# EasyEDA Pro project CustomDevKit.epro, board SimWheelKit_unified_REV2
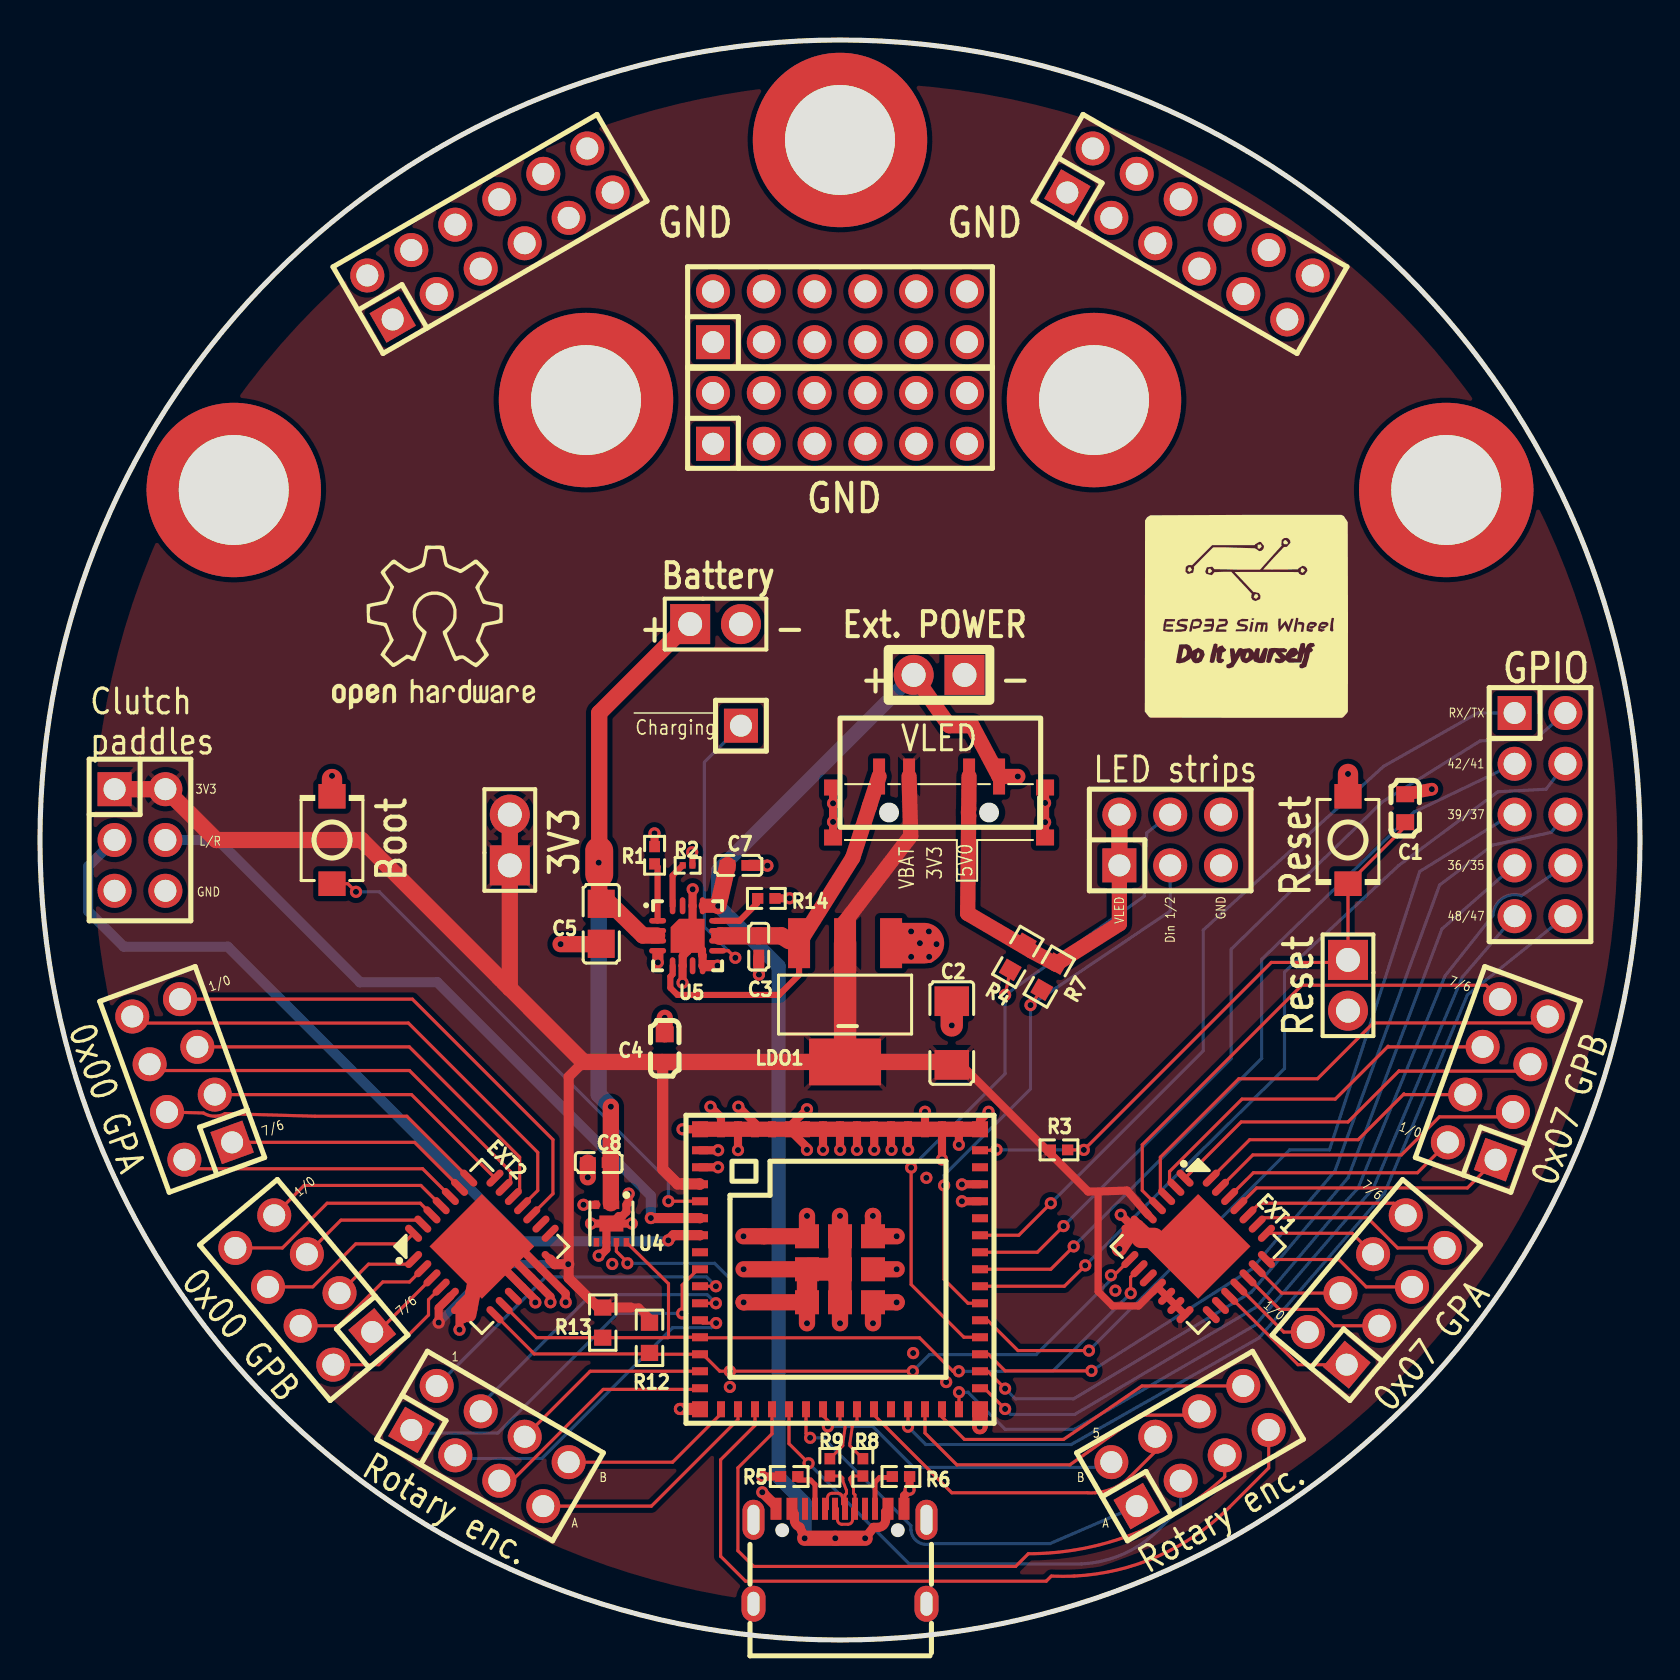
[diagram p10: board, top side]
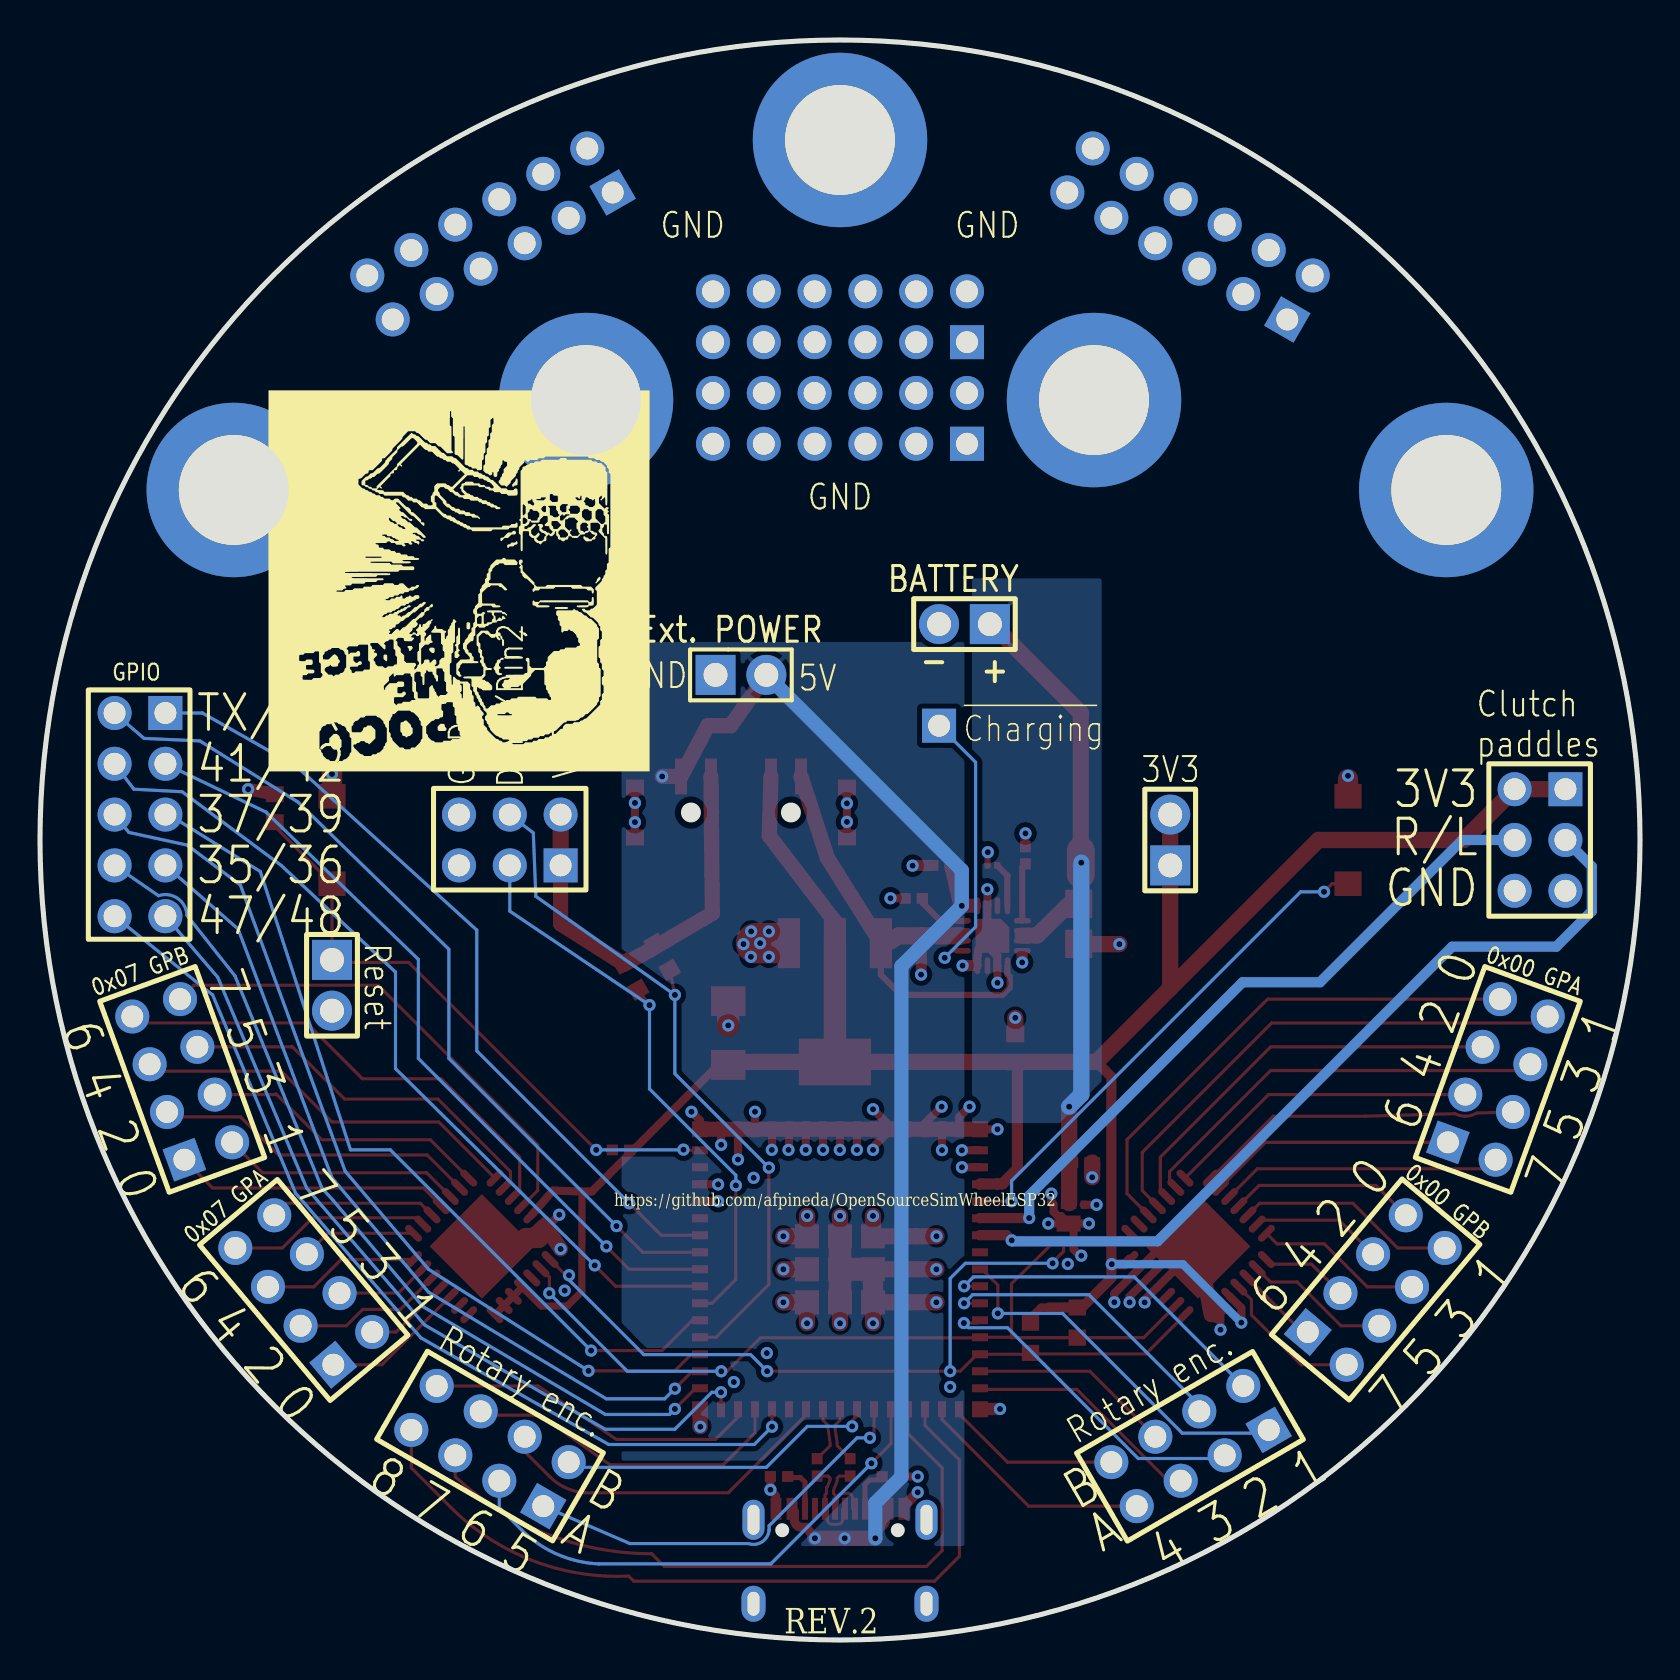
[diagram p11: board, bottom side, seen from below]

Outline 80 x 80 mm; copper layers: Top Layer, Inner1, Inner2, Bottom Layer. Coordinates in mm from the lower left corner of the outline.
Outline path: circle c40,40 r40
Stack: Top Layer 0.035mm Outer layer thickness 1oz / Dielectric1 0.0994mm 3313 RC57% 4.2mil / Inner1 0.0152mm Inner layer thickness / Dielectric2 1.265mm 1.3mm H/HOZ Copper / Inner2 0.0152mm Inner layer thickness / Dielectric3 0.0994mm 3313 RC57% 4.2mil / Bottom Layer 0.035mm Outer layer thickness 1oz

## Design rules (mm)
net GND: Power
net 3V3: Power
net VBUS: Power
net POT1: Clutch
net POT2: Clutch
net XGPB4: Switches
net XGPB5: Switches
net XGPB6: Switches
net XGPB7: Switches
net SCL: I2C
net SDA: I2C
net XGPA0: Switches
net XGPA1: Switches
net XGPA2: Switches
net XGPA3: Switches
net XGPA4: Switches
net XGPA5: Switches
net XGPA6: Switches
net XGPA7: Switches
net XGPB0: Switches
net XGPB1: Switches
net XGPB2: Switches
net XGPB3: Switches
net YGPB4: Switches
net YGPB5: Switches
net YGPB6: Switches
net YGPB7: Switches
net YGPA0: Switches
net YGPA1: Switches
net YGPA2: Switches
net YGPA3: Switches
net YGPA4: Switches
net YGPA5: Switches
net YGPA6: Switches
net YGPA7: Switches
net YGPB0: Switches
net YGPB1: Switches
net YGPB2: Switches
net YGPB3: Switches
net STRIP1: LedStrip
net STRIP2: LedStrip
net USB_D+: USB, USB_IN
net USB_DP_CONN: USB, USB_CONN
net USB_D-: USB, USB_IN
net USB_DN_CONN: USB, USB_CONN
net ROT1A: Rotaries
net ROT1B: Rotaries
net ROT2A: Rotaries
net ROT2B: Rotaries
net ROT3A: Rotaries
net ROT3B: Rotaries
net ROT4A: Rotaries
net ROT4B: Rotaries
net ROT5A: Rotaries
net ROT5B: Rotaries
net ROT6A: Rotaries
net ROT6B: Rotaries
net ROT7A: Rotaries
net ROT7B: Rotaries
net ROT8A: Rotaries
net ROT8B: Rotaries
net VIN: Power
net VBAT: Power
template: Custom Config
spacing copperThickness1oz (default): track to track 0.102, other pairs 0.152 to 0.3
spacing copperThickness2oz: track to track 0.203, other pairs 0.152 to 0.3
track width copperThickness1oz (default): min 0.127, default 0.157, max 2.54
track width copperThickness2oz: min 0.203, default 0.254, max 2.54
track width Power1oz: min 0.254, default 0.406, max 2.54
differential pair differentialPair (default): width min 0.145, default 0.147, max 0.15; gap min 0.203, default 0.203
via viaSize (default): diameter min 0.5, default 0.61, max 10; hole min 0.3, default 0.305, max 6.3
net class Power uses Power1oz
net GND uses Power1oz
net 3V3 uses Power1oz
net VBUS uses Power1oz
net VIN uses Power1oz
net VBAT uses Power1oz

## Placement (name value [footprint] x y rotation side)
BATTH1  PZ254V-11-02P  [HDR-TH_2P-P2.54-V-M]  33.78 50.8 0 top
C1  100nF  [C0603]  68.26 41.59 270 top
C2  10uF  [C1206]  45.59 30.35 270 top
C3  10uF  [C0402]  35.94 34.67 270 top
C4  100nF  [C0603]  31.24 29.59 270 top
C5  4.7uF  [C0805]  28.06 35.81 90 top
C7  1uF  [C0402]  34.92 38.73 180 top
C8  100nF  [C0402]  27.94 23.87 0 top
CHRGH1  PZ254V-11-01P  [HDR-TH_1P-P2.54-V-M]  35.05 45.72 0 top
CLH1  PZ254V-12-6P  [HDR-TH_6P-P2.54-V-M-R2-C3-S2.54]  5 40 270 top
EXT1  MCP23017T-E/ML  [QFN-28_L6.0-W6.0-P0.65-BL-EP3.7]  57.91 19.68 225 top
EXT2  MCP23017T-E/ML  [QFN-28_L6.0-W6.0-P0.65-BL-EP3.7]  22.09 19.68 315 top
GNDH1  PZ254V-12-12P  [HDR-TH_12P-P2.54-V-M-R2-C6-S2.54]  40 61.08 0 top
GNDH2  PZ254V-12-12P  [HDR-TH_12P-P2.54-V-M-R2-C6-S2.54]  40 66.16 0 top
GNDH3  PZ254V-12-12P  [HDR-TH_12P-P2.54-V-M-R2-C6-S2.54]  22.5 70.3 30 top
GNDH4  PZ254V-12-12P  [HDR-TH_12P-P2.54-V-M-R2-C6-S2.54]  57.5 70.3 330 top
GPIOH1  PZ254V-12-10P  [HDR-TH_10P-P2.54-V-M-R2-C5-S2.54]  75 41.27 270 top
LDO1  AMS1117-3.3  [SOT-223-3_L6.5-W3.4-P2.30-LS7.0-BR]  40.25 31.87 90 top
LEDH1  PZ254V-12-6P  [HDR-TH_6P-P2.54-V-M-R2-C3-S2.54]  56.51 40 0 top
NOREF  -  [Pad_e69]  52.7 62 0 top
NOREF#2  -  [Pad_e56]  27.3 62 0 top
NOREF#3  -  [Pad_e66]  9.69 57.5 0 top
NOREF#4  -  [Pad_e63]  40 75 0 top
NOREF#5  -  [Pad_e1782]  70.31 57.5 0 top
PWRH1  PZ254V-11-02P  [HDR-TH_2P-P2.54-V-M]  44.95 48.25 180 bottom
PWRH2  PZ254V-11-02P  [HDR-TH_2P-P2.54-V-M]  23.49 40 90 top
R1  10kΩ  [R0402]  30.73 39.24 270 top
R2  3kΩ  [R0201]  32.38 38.73 180 top
R3  10kΩ  [R0402]  50.95 24.5 180 top
R4  1kΩ  [R0603]  48.89 34.16 60 top
R5  5.1kΩ  [R0402]  37.46 8.17 0 top
R6  5.1kΩ  [R0402]  43.05 8.17 180 top
R7  1kΩ  [R0603]  50.47 33.17 60 top
R8  23.2Ω  [R0402]  41.14 8.63 90 top
R9  23.2Ω  [R0402]  39.49 8.63 90 top
R12  3kΩ  [R0603]  30.47 15.11 90 top
R13  3kΩ  [R0603]  28.14 15.87 90 top
R14  1.5kΩ  [R0402]  36.32 37.08 180 top
RESETH1  PZ254V-11-02P  [HDR-TH_2P-P2.54-V-M]  65.4 32.74 270 top
ROTH1  PZ254V-12-8P  [HDR-TH_8P-P2.54-V-M-R2-C4-S2.54]  22.5 9.7 330 top
ROTH2  PZ254V-12-8P  [HDR-TH_8P-P2.54-V-M-R2-C4-S2.54]  57.5 9.7 30 top
SW1  TS-1088-AR02016  [SW-SMD_L3.9-W3.0-P4.45]  65.4 40 270 top
SW2  TS-1088-AR02016  [SW-SMD_L3.9-W3.0-P4.45]  14.6 40 90 top
SW3  MSK13C02-SZ  [SW-SMD_MSK13C02-SZ]  44.95 41.65 0 top
SWH1  PZ254V-12-8P  [HDR-TH_8P-P2.54-V-M-R2-C4-S2.54]  66.81 17.5 50 top
SWH2  PZ254V-12-8P  [HDR-TH_8P-P2.54-V-M-R2-C4-S2.54]  72.89 28.03 70 top
SWH3  PZ254V-12-8P  [HDR-TH_8P-P2.54-V-M-R2-C4-S2.54]  13.19 17.5 130 top
SWH4  PZ254V-12-8P  [HDR-TH_8P-P2.54-V-M-R2-C4-S2.54]  7.11 28.03 110 top
U1  2.4GHz  [BULETM-SMD_ESPRESSIF_ESP32-S3-MINI-1U-N8]  40 18.54 0 top
U4  MAX17048G+T10  [TDFN-8_L2.0-W2.0-P0.50-BL-EP1.2]  28.57 20.82 180 top
U5  BQ24074RGTR  [QFN-16_L3.0-W3.0-P0.50-TL-EP1.7]  32.38 35.21 0 top
USB1  TYPE-C 16PIN 2MD(073)  [USB-C-SMD_TYPE-C-6PIN-2MD-073]  40 4.19 0 top

## Footprints (pads in the part's own frame, mm; a bottom-side part is the same pattern mirrored in y, then rotated)
BULETM-SMD_ESPRESSIF_ESP32-S3-MINI-1U-N8
  rect 0.8x0.4 smd: 1(-7,5.95) 2(-7,5.1) 3(-7,4.25) 4(-7,3.4) 5(-7,2.55) 6(-7,1.7) 7(-7,0.85) 8(-7,0) 9(-7,-0.85) 10(-7,-1.7) 11(-7,-2.55) 12(-7,-3.4) 13(-7,-4.25) 14(-7,-5.1) 15(-7,-5.95) 31(7,-5.95) 32(7,-5.1) 33(7,-4.25) 34(7,-3.4) 35(7,-2.55) 36(7,-1.7) 37(7,-0.85) 38(7,0) 39(7,0.85) 40(7,1.7) 41(7,2.55) 42(7,3.4) 43(7,4.25) 44(7,5.1) 45(7,5.95)
  rect 0.4x0.8 smd: 16(-5.95,-7) 17(-5.1,-7) 18(-4.25,-7) 19(-3.4,-7) 20(-2.55,-7) 21(-1.7,-7) 22(-0.85,-7) 23(0,-7) 24(0.85,-7) 25(1.7,-7) 26(2.55,-7) 27(3.4,-7) 28(4.25,-7) 29(5.1,-7) 30(5.95,-7) 46(5.95,7) 47(5.1,7) 48(4.25,7) 49(3.4,7) 50(2.55,7) 51(1.7,7) 52(0.85,7) 53(0,7) 54(-0.85,7) 55(-1.7,7) 56(-2.55,7) 57(-3.4,7) 58(-4.25,7) 59(-5.1,7) 60(-5.95,7)
  custom 1.2x1.2 smd: 61(-1.65,1.65)
  rect 1.2x1.2 smd: 61(-1.65,0) 61(-1.65,-1.65) 61(0,1.65) 61(0,0) 61(0,-1.65) 61(1.65,1.65) 61(1.65,0) 61(1.65,-1.65)
  rect 0.8x0.8 smd: 62(-7,7) 63(-7,-7) 64(7,-7) 65(7,7)
C0402
  rect 0.79x0.54 smd: 1(-0.545,0) 2(0.545,0)
C0603
  rect 0.8x0.9 smd: 1(-0.7,0) 2(0.7,0)
C0805
  rect 1.41x1.35 smd: 1(-1,0) 2(1,0)
C1206
  rect 1.485x1.728 smd: 1(-1.593,0) 2(1.593,0)
HDR-TH_1P-P2.54-V-M
  rect 1.7x1.7 hole 1.1: 1(0,0)
HDR-TH_2P-P2.54-V-M
  rect 2x2 hole 1.2: 1(-1.27,0)
  round 2 hole 1.2: 2(1.27,0)
HDR-TH_6P-P2.54-V-M-R2-C3-S2.54
  rect 1.7x1.7 hole 1.1: 1(-2.54,-1.27)
  round 1.7 hole 1.1: 2(-2.54,1.27) 3(0,-1.27) 4(0,1.27) 5(2.54,-1.27) 6(2.54,1.27)
HDR-TH_8P-P2.54-V-M-R2-C4-S2.54
  rect 1.7x1.7 hole 1.1: 1(-3.81,-1.27)
  round 1.7 hole 1.1: 2(-3.81,1.27) 3(-1.27,-1.27) 4(-1.27,1.27) 5(1.27,-1.27) 6(1.27,1.27) 7(3.81,-1.27) 8(3.81,1.27)
HDR-TH_10P-P2.54-V-M-R2-C5-S2.54
  rect 1.7x1.7 hole 1.1: 1(-5.08,-1.27)
  round 1.7 hole 1.1: 2(-5.08,1.27) 3(-2.54,-1.27) 4(-2.54,1.27) 5(0,-1.27) 6(0,1.27) 7(2.54,-1.27) 8(2.54,1.27) 9(5.08,-1.27) 10(5.08,1.27)
HDR-TH_12P-P2.54-V-M-R2-C6-S2.54
  rect 1.7x1.7 hole 1.1: 1(-6.35,-1.27)
  round 1.7 hole 1.1: 2(-6.35,1.27) 3(-3.81,-1.27) 4(-3.81,1.27) 5(-1.27,-1.27) 6(-1.27,1.27) 7(1.27,-1.27) 8(1.27,1.27) 9(3.81,-1.27) 10(3.81,1.27) 11(6.35,-1.27) 12(6.35,1.27)
Pad_e56
  round 8.72 hole 5.499: 1(0,0)
Pad_e63
  round 8.72 hole 5.499: 1(0,0)
Pad_e66
  round 8.72 hole 5.499: 1(0,0)
Pad_e69
  round 8.72 hole 5.499: 1(0,0)
Pad_e1782
  round 8.72 hole 5.499: 1(0,0)
QFN-16_L3.0-W3.0-P0.50-TL-EP1.7
  oval 0.85x0.28 smd: 1(-1.5,0.75) 2(-1.5,0.25) 3(-1.5,-0.25) 4(-1.5,-0.75) 9(1.5,-0.75) 10(1.5,-0.25) 11(1.5,0.25) 12(1.5,0.75)
  oval 0.28x0.85 smd: 5(-0.75,-1.5) 6(-0.25,-1.5) 7(0.25,-1.5) 8(0.75,-1.5) 13(0.75,1.5) 14(0.25,1.5) 15(-0.25,1.5) 16(-0.75,1.5)
  custom 1.7x1.7 smd: 17(0,0)
QFN-28_L6.0-W6.0-P0.65-BL-EP3.7
  oval 0.364x1.055 smd: 1(-1.95,-2.877) 2(-1.3,-2.877) 3(-0.65,-2.877) 4(0,-2.877) 5(0.65,-2.877) 6(1.3,-2.877) 7(1.95,-2.877) 15(1.95,2.877) 16(1.3,2.877) 17(0.65,2.877) 18(0,2.877) 19(-0.65,2.877) 20(-1.3,2.877) 21(-1.95,2.877)
  oval 1.055x0.364 smd: 8(2.877,-1.95) 9(2.877,-1.3) 10(2.877,-0.65) 11(2.877,0) 12(2.877,0.65) 13(2.877,1.3) 14(2.877,1.95) 22(-2.877,1.95) 23(-2.877,1.3) 24(-2.877,0.65) 25(-2.877,0) 26(-2.877,-0.65) 27(-2.877,-1.3) 28(-2.877,-1.95)
  rect 3.7x3.7 smd: 29(0,0)
R0201
  rect 0.303x0.324 smd: 1(-0.241,0) 2(0.241,0)
R0402
  rect 0.566x0.54 smd: 1(-0.433,0) 2(0.433,0)
R0603
  rect 0.806x0.864 smd: 1(-0.753,0) 2(0.753,0)
SOT-223-3_L6.5-W3.4-P2.30-LS7.0-BR
  rect 2.5x1.1 smd: 1(2.97,-2.3) 2(2.97,0) 3(2.97,2.3)
  rect 2.34x3.6 smd: 4(-2.97,0)
SW-SMD_L3.9-W3.0-P4.45
  rect 1.23x1.36 smd: 1(-2.185,0) 2(2.185,0)
SW-SMD_MSK13C02-SZ
  rect 0.6x1.8 smd: 1(-3,1.526) 2(-1.5,1.526) 3(1.5,1.526) 4(3,1.526)
  rect 0.9x0.8 smd: 5(-5.3,0.975) 5(-5.3,-1.526) 6(5.3,0.975) 6(5.3,-1.526)
TDFN-8_L2.0-W2.0-P0.50-BL-EP1.2
  rect 0.28x0.425 smd: 1(-0.75,-0.938) 2(-0.25,-0.938) 3(0.25,-0.938) 4(0.75,-0.938) 5(0.75,0.938) 6(0.25,0.938) 7(-0.25,0.938) 8(-0.75,0.938)
  rect 1.2x0.8 smd: 9(0,0)
USB-C-SMD_TYPE-C-6PIN-2MD-073
  rect 0.55x1.1 smd: 1(-3.2,2.375) 2(-2.4,2.375) 11(2.4,2.375) 12(3.2,2.375)
  rect 0.3x1.1 smd: 3(-1.75,2.375) 4(-1.25,2.375) 5(-0.75,2.375) 6(-0.25,2.375) 7(0.25,2.375) 8(0.75,2.375) 9(1.25,2.375) 10(1.75,2.375)
  oval 1.1x2 hole 0.6x1.5: 13(-4.325,1.825) 14(4.325,1.825)
  oval 1.2x1.8 hole 0.6x1.2: 13(-4.325,-2.375) 14(4.325,-2.375)

## Nets
As in the schematic, except:
GND: BATTH1.2 C1.1 C2.1 C3.2 C4.1 C5.1 C7.1 C8.1 CLH1.5 CLH1.6 EXT1.6 EXT1.7 EXT1.29 EXT2.6 EXT2.7 EXT2.11 EXT2.12 EXT2.13 EXT2.29 GNDH1.1 GNDH1.2 GNDH1.3 GNDH1.4 GNDH1.5 GNDH1.6 GNDH1.7 GNDH1.8 GNDH1.9 GNDH1.10 GNDH1.11 GNDH1.12 GNDH2.1 GNDH2.2 GNDH2.3 GNDH2.4 GNDH2.5 GNDH2.6 GNDH2.7 GNDH2.8 GNDH2.9 GNDH2.10 GNDH2.11 GNDH2.12 GNDH3.1 GNDH3.2 GNDH3.3 GNDH3.4 GNDH3.5 GNDH3.6 GNDH3.7 GNDH3.8 GNDH3.9 GNDH3.10 GNDH3.11 GNDH3.12 GNDH4.1 GNDH4.2 GNDH4.3 GNDH4.4 GNDH4.5 GNDH4.6 GNDH4.7 GNDH4.8 GNDH4.9 GNDH4.10 GNDH4.11 GNDH4.12 LDO1.1 LEDH1.5 LEDH1.6 NOREF.1 NOREF#2.1 NOREF#3.1 NOREF#4.1 NOREF#5.1 PWRH1.1 R1.1 R2.1 R5.1 R6.1 R14.1 RESETH1.2 SW1.1 SW2.2 SW3.5 SW3.6 U1.1 U1.2 U1.42 U1.43 U1.46 U1.47 U1.48 U1.49 U1.50 U1.51 U1.52 U1.53 U1.54 U1.55 U1.56 U1.57 U1.58 U1.59 U1.60 U1.61 U1.62 U1.63 U1.64 U1.65 U4.1 U4.4 U4.6 U4.9 U5.4 U5.6 U5.8 U5.14 U5.17 USB1.1 USB1.12 USB1.13 USB1.14

Pads without a net: EXT1 10 15 16; EXT2 10 15 16; U1 7 26 41 44; U4 5; U5 7 15; USB1 3 9

## Via types
v1: diameter 0.61, hole 0.305, Top Layer to Bottom Layer, 123 vias

## Routing (per net, layer and track width the routed paths; a pad name or vN(x,y) marks a point on that pad's centre or on a via; arc(x,y) is an arc through that point)
3V3: length 128.9
  Top Layer w0.364: EXT1.14 EXT1.13 EXT1.12 EXT1.11 54.93,16.7 53.63,16.7 52.91,17.42 52.9,22.42
  Top Layer w0.406: v1(19.93,15.87) 19.93,16.6 EXT2.5 ; EXT1.5 54.35,22.47 52.9,22.42 52.41,22.42 46.08,28.76 45.33,28.76 ; 30.47,15.73 30.47,16.09 29.94,16.62 29.53,16.62
  Top Layer w0.508: EXT2.14 25.74,18.79 v1(26.41,18.79) ; 29.53,16.62 27.91,16.62 26.43,18.1 26.43,28.16 27.17,28.9
  Top Layer w0.559: 32.13,22.8 32.15,22.79 ; 32.13,22.8 31.88,22.8 31.13,23.55 31.13,28.88 31.11,28.9 ; 32.13,22.8 32.98,22.8 U1.3
  Top Layer w0.762: SW3.2 43.54,40.21 40.21,35.86 40.3,35.23
  Top Layer w0.813: 23.49,32.59 27.17,28.9 ; 23.49,32.59 PWRH2.1 PWRH2.2 ; 23.49,32.59 16.08,40 8.81,40 CLH1.2 CLH1.1 ; 45.28,28.9 27.3,28.9
  Top Layer w1.117: 40,28.9 40.25,29.16 LDO1.2
  Bottom Layer w0.406: v1(26.41,18.79) 22.85,18.79 v1(19.93,15.87)
GND: length 124.2
  Top Layer w0.305: R2.1 32.62,39.38 v1(32.61,39.39)
  Top Layer w0.406: v1(30.72,40.33) 30.73,40.33 R1.1 ; 43.2,6.81 43.2,7.21 43.5,7.51 ; v1(33.52,26.67) 34.05,26.14 U1.60 ; v1(36.11,8.17) R5.1 ; U5.8 33.13,34.23 33.1,34.26 33.1,34.49 U5.17 ; v1(32.13,32.86) 32.13,32.87 U5.6 32.13,33.72 32.13,34.2 32.38,34.45 U5.17 ; v1(34.92,26.67) 35.75,25.83 U1.58 ; U1.1 v1(33.91,24.49) ; U1.51 41.71,25.52 v1(41.71,24.51) ; U1.43 46.1,22.79 v1(46.1,22.78) ; v1(29.43,22.32) 29.43,21.87 U4.1 29.32,21.41 29.11,21.19 28.94,21.19 U4.9 ; U5.17 32.63,35.46 U5.14 32.63,36.71 32.63,37.53 v1(32.63,37.54) ; 21.66,17.4 EXT2.6 20.98,15.52 v1(20.98,15.51) ; v1(45.94,24.76) 45.94,25.53 U1.46 ; U4.9 v1(29.59,20.82) ; U4.9 v1(27.55,20.82) ; U4.9 28.32,20.57 U4.6 28.32,19.53 28.11,19.32 28.04,19.32 v1(27.94,19.22) ; v1(24.77,16.88) 24.77,17 EXT2.11 EXT2.29 ; U1.59 v1(34.9,24.49) ; v1(42.58,24.51) 42.55,24.53 U1.50 ; SW3.6 v1(50.25,41.85) v1(50.25,40.89) SW3.6 ; U1.2 v1(33.9,23.64) ; v1(26.28,16.89) 26.28,17.33 23.93,19.68 23.01,19.68 EXT2.12 25.52,17.17 v1(25.52,16.89) ; R14.1 v1(37.48,37.09) ; U1.65 47,25.98 v1(47.43,26.41) ; v1(54.04,21.26) 54.51,20.8 54.95,20.8 55.7,20.1 EXT1.29 ; U1.53 40,24.51 v1(40.01,24.51) ; U1.56 38.35,24.64 v1(38.35,24.51) ; U1.49 43.4,24.51 v1(43.41,24.51) ; U1.62 v1(32.13,25.54) ; U1.42 v1(46.1,21.94) ; 37.35,25.54 v1(38.35,26.54) ; v1(27.17,21.76) U4.4 ; SW3.5 v1(39.65,40.91) v1(39.65,41.83) SW3.5 ; U1.48 v1(44.25,26.41) ; R6.1 v1(43.48,7.51) ; U1.52 40.85,24.51 ; U1.47 v1(45.1,24.03) ; v1(39.15,24.51) 39.15,24.51 U1.54
  Top Layer w0.508: v1(36.11,7.39) 36.8,6.7 USB1.1 ; 54.48,20.7 55.07,20.1
  Top Layer w0.559: v1(33.87,33.72) 33.21,33.72 33.2,33.71 ; v1(30.89,33.88) 30.89,34.28 ; C7.1 36.36,38.73 v1(36.37,38.72) ; C3.2 35.94,33.28 v1(35.95,33.27)
  Top Layer w0.61: U1.63 32.99,11.55 v1(32,11.55)
  Top Layer w0.635: C1.1 v1(69.59,42.54)
  Top Layer w0.762: EXT1.7 v1(53.97,19.55) ; U1.56 U1.55 U1.54 U1.53 U1.52 U1.51 U1.50 U1.49 U1.48 U1.47 U1.46 U1.65 ; U1.62 U1.60 U1.59 U1.58 U1.57 37.35,25.54 ; U1.64 47,10.68 v1(46.99,10.66) ; 21.44,16.27 21.66,17.4 EXT2.29
  Top Layer w0.813: v1(35.18,20.19) U1.61 v1(38.35,21.2) ; v1(41.65,15.84) U1.61 42.83,16.89 v1(42.83,16.88) ; U1.61 v1(40,21.2) ; U1.61 v1(40,15.84) ; U1.61 v1(42.83,18.54) ; v1(42.83,20.19) U1.61 41.65,21.2 v1(41.65,21.2) ; v1(35.18,16.88) 35.19,16.89 U1.61 v1(38.35,15.84) ; v1(26.03,34.79) 28.05,34.79 C5.1 ; U1.61 v1(35.18,18.54) ; C8.1 v1(27.39,23.14) ; C4.1 v1(31.24,31.11)
  Top Layer w1.016: 55.07,20.1 55.7,20.1 ; SW1.1 v1(65.4,43.3) ; U1.61 U1.61 ; SW2.2 14.6,43.05
  Top Layer w1.117: v1(45.59,30.73) 45.59,31.69 45.33,31.94
  Top Layer w1.143: U1.61 U1.61 ; U1.61 U1.61 ; U1.61 U1.61
  Top Layer w2.032: 43.05,34.84 44.19,34.84
  vias: v1(14.6,43.21) v1(28.61,18.8) v1(34.49,12.65) v1(40.85,24.51) v1(43.56,35.43) v1(43.56,34.16) v1(43.66,14.35) v1(44,34.84) v1(44.32,23.11) v1(44.44,35.43) v1(44.46,34.16) v1(44.83,34.79) v1(45.31,12.9) v1(53.77,17.47)
VBAT: length 36.4
  Top Layer w0.813: v1(28.54,26.67) 28.54,21.84 ; 32.51,50.8 32.41,50.8 27.96,46.35 27.96,39.47 ; 30.86,35.22 30.15,35.22 27.96,37.36 27.96,38.29
  Top Layer w1.397: 27.96,39.47 27.96,38.29
  Bottom Layer w0.813: v1(27.94,38.87) 27.94,27.27 v1(28.54,26.67)
VBUS: length 67.1
  Top Layer w0.406: 42.44,6.33 42.43,6.56 42.41,6.84
  Top Layer w0.457: USB1.2 37.72,6.28 37.72,6.01 arc(37.8,5.78) 37.99,5.65 v1(38.24,5.09) ; v1(41.26,5.09) 41.68,5.63 41.9,5.63 arc(42.17,5.74) 42.28,6.01 42.28,6.41 USB1.11
  Top Layer w0.711: v1(33.91,36.71) 33.29,36.71
  Top Layer w0.762: PWRH1.2 45.46,45.72 46.6,45.72 SW3.4 v1(48.89,43.18) ; 38.24,5.09 v1(39.76,5.09) v1(41.26,5.09)
  Top Layer w0.838: C7.2 v1(33.91,36.71)
  Bottom Layer w0.711: v1(38.24,5.09) 38.24,6.85 36.93,8.16 36.93,33.69 v1(33.91,36.71) 33.91,38.48 PWRH1.2
VIN: length 22.6
  Top Layer w0.305: U5.5 31.63,33.28 31.52,33.17 31.52,32.61 31.87,32.25 36.95,32.25 37.95,33.25 LDO1.3
  Top Layer w0.762: LDO1.3 40.63,39.11 41.45,41.63 arc(41.47,41.69) 41.49,41.75 SW3.1
  Top Layer w0.864: 33.99,35.19 34.01,35.21 37.07,35.21 37.45,34.97
CHARGING#: length 14
  Top Layer w0.158: v1(34.77,34.11) 34.41,34.46 U5.9
  Bottom Layer w0.158: v1(34.77,34.11) 33.22,35.66 33.22,43.89 CHRGH1.1
EN: length 31.2
  Top Layer w0.158: 51.38,24.5 v1(52.19,24.5) 61.56,33.88 65.27,33.88 RESETH1.1 SW1.2 68.26,40.67 C1.2 ; U1.45 47.8,24.49 v1(47.83,24.52)
  Bottom Layer w0.158: v1(52.19,24.5) 47.84,24.5 v1(47.83,24.52)
IO0: length 25.6
  Top Layer w0.158: SW2.1 15.39,37.81 v1(15.8,37.41) ; U1.4 31.42,21.94 v1(31.42,21.94)
  Bottom Layer w0.158: v1(31.42,21.94) 31.42,22.96 16.97,37.41 v1(15.8,37.41)
IO35: length 43.7
  Top Layer w0.158: v1(48.25,11.55) 47.22,12.59 U1.31
  Bottom Layer w0.158: v1(48.25,11.55) 48.53,11.28 51.73,11.28 60.85,16.67 65.34,21.98 65.91,22.6 70.26,33.21 72.65,36.23 arc(73.12,37.08) 74.07,37.22 GPIOH1.8
IO36: length 41.2
  Top Layer w0.158: U1.32 47.39,13.44 v1(48.25,12.57)
  Bottom Layer w0.158: v1(48.25,12.57) 48.76,12.06 51.68,12.06 60.57,17.39 65.4,23.11 70.1,35.56 GPIOH1.7
IO37: length 44.5
  Top Layer w0.158: v1(52.57,13.46) 48.25,13.46 47.43,14.29 U1.33
  Bottom Layer w0.158: GPIOH1.6 75.56,40.38 72.64,39.75 69.98,37.75 64.74,23.44 60.57,18.54 v1(52.57,13.46)
IO39: length 42.5
  Top Layer w0.158: U1.35 47.38,15.99 48.9,14.47 v1(52.45,14.47)
  Bottom Layer w0.158: GPIOH1.5 73.61,41.3 68.99,38.42 64.47,24.51 62.48,24.51 v1(52.45,14.47)
IO41: length 42.5
  Top Layer w0.158: v1(52.26,18.73) 51.22,17.69 U1.37
  Bottom Layer w0.158: v1(52.26,18.73) 62.22,28.57 62.22,33.4 67.94,38.73 72.89,42.41 75.31,42.54 GPIOH1.4
IO42: length 39.6
  Top Layer w0.158: U1.38 50.54,18.54 v1(51.68,19.68)
  Bottom Layer w0.158: v1(51.68,19.68) 61.08,29.08 61.08,34.03 68.7,41.4 GPIOH1.3
IO47: length 46.8
  Top Layer w0.158: U1.27 v1(43.4,10.66)
  Bottom Layer w0.158: GPIOH1.10 71.37,32.25 67.21,22.32 67.1,22.2 60.96,15.11 51.56,9.77 44.29,9.77 v1(43.4,10.66)
IO48: length 42.3
  Top Layer w0.158: U1.30 v1(45.95,12.39)
  Bottom Layer w0.158: v1(45.95,12.39) 46.41,12.39 48.25,10.54 51.73,10.54 60.77,15.76 66.67,22.6 71.12,33.14 GPIOH1.9
POT1: length 35.2
  Top Layer w0.508: v1(30.54,21.1) 32.99,21.1 33,21.09
  Bottom Layer w0.508: v1(30.54,21.1) 30.54,22.22 19.87,32.89 16,32.89 8.89,40 CLH1.4
POT2: length 41.7
  Top Layer w0.508: U1.6 33,20.24 31.67,20.24 v1(31.41,19.98)
  Bottom Layer w0.508: CLH1.3 2.41,38.68 2.41,36.44 4.19,34.67 9.39,34.67 24.12,19.93 31.37,19.93 v1(31.41,19.98)
ROT1A: length 18.7
  Top Layer w0.158: v1(32.11,16.33) 32.11,17.75 32.82,18.46 32.92,18.46 U1.8
  Bottom Layer w0.158: ROTH1.1 18.72,10.35 22.89,10.35 28.87,16.33 v1(32.11,16.33)
ROT1B: length 17.2
  Top Layer w0.158: v1(33.8,17.69) U1.9
  Bottom Layer w0.158: v1(33.8,17.69) 33.33,18.16 25.29,18.16 19.84,12.7
ROT2A: length 16.8
  Top Layer w0.158: U1.11 33.14,15.85 v1(33.81,15.85)
  Bottom Layer w0.158: 20.76,9.23 20.92,9.08 25.09,9.08 31.63,15.62 33.57,15.62 v1(33.81,15.85)
ROT2B: length 15.3
  Top Layer w0.158: v1(33.8,16.84) 33,16.84
  Bottom Layer w0.158: ROTH1.4 22.03,11.75 27.55,17.27 33.37,17.27 v1(33.8,16.84)
ROT3A: length 12
  Top Layer w0.158: ROTH1.5 23.59,7.96 28.16,12.53 32.94,12.53 U1.15
ROT3B: length 10.1
  Top Layer w0.158: U1.14 27.51,13.44 ROTH1.6
ROT4A: length 12
  Top Layer w0.158: U1.17 34.9,11.02 30.57,6.69 25.16,6.69
ROT4B: length 8.8
  Top Layer w0.158: U1.16 34.05,11.31 31.63,8.89 ROTH1.8
ROT5A: length 20.7
  Top Layer w0.158: U1.21 38.3,10.31 v1(38.51,10.11)
  Bottom Layer w0.158: v1(38.51,10.11) 39.15,10.11 43.54,5.71 43.54,5.49 43.55,5.49 arc(43.9,4.91) 44.57,4.82 50.5,4.82 54.84,6.69
ROT5B: length 16.1
  Top Layer w0.158: v1(39.39,10.68) 39.39,10.97 39.15,11.21 U1.22
  Bottom Layer w0.158: v1(39.39,10.68) 41.63,10.68 43.68,8.63 53.3,8.63 ROTH2.2
ROT6A: length 26.1
  Top Layer w0.158: U1.20 37.45,9.82 v1(38.43,8.84)
  Bottom Layer w0.158: v1(38.43,8.84) 43.46,3.81 52.07,3.81 arc(54.16,4.3) 55.93,5.51 57.04,6.62 ROTH2.3
ROT6B: length 17.4
  Top Layer w0.158: ROTH2.4 55.77,9.42 54.5,8.16 arc(53.7,7.6) 52.75,7.36 arc(52.56,7.35) 52.37,7.36 45.59,7.36 41.7,11.25 U1.25
ROT7A: length 34.8
  Top Layer w0.158: 59.24,9.23 59.24,8.16 arc(54.69,5.31) 49.42,4.31 48.78,3.68 35.68,3.68 34.89,4.47 34.89,8.61 36.6,10.31 U1.19
ROT7B: length 16.4
  Top Layer w0.158: U1.28 44.25,10.35 45.84,8.76 51.49,8.76 54.97,11.23 arc(55.14,11.24) 55.31,11.24 57.78,11.24 ROTH2.6
ROT8A: length 39.7
  Top Layer w0.158: U1.18 35.75,10.73 34.03,9.01 34.03,4.19 35.28,2.94 50.31,2.94 50.57,3.2 arc(51.13,3.18) 51.7,3.2 arc(55.9,4.19) 59.46,6.63 61.44,8.6 ROTH2.7
ROT8B: length 16.7
  Top Layer w0.158: U1.29 45.1,11.15 46.22,10.03 51.18,10.03 55.1,12.7 60.16,12.7
RX: length 40.5
  Top Layer w0.158: v1(50.54,21.84) 48.94,20.24 U1.40
  Bottom Layer w0.158: v1(50.54,21.84) 58.16,29.46 58.16,35.5 67.18,43.68 71.88,46.35 GPIOH1.1
SCL: length 46.7
  Top Layer w0.158: U1.13 33.14,14.29 33.99,13.44 v1(34.49,13.44) v1(43.64,13.44) ; U1.13 33.01,14.3 ; U1.13 30.77,14.29 30.75,14.3 24.71,14.3 EXT2.8 ; v1(29.37,18.84) 29.37,18.88 28.82,19.43 28.82,19.88 ; v1(53.55,18.24) 53.71,18.24 EXT1.8
  Bottom Layer w0.158: v1(53.55,18.24) 53.55,18.01 49.81,14.27 44.47,14.27 v1(43.64,13.44) ; v1(29.37,18.84) 33.73,18.84 34.49,18.07 v1(34.49,13.44)
SDA: length 41.4
  Top Layer w0.158: v1(45.94,13.44) 45.65,13.44 43.98,15.11 33.03,15.11 U1.12 31.43,15.14 ; 31.43,15.14 31.4,15.12 R13.1 24.82,15.12 EXT2.9 ; 31.43,15.14 31.43,17.82 U4.8 ; 54.95,18.56 54.53,18.14 54.53,17.35 v1(54.54,17.34)
  Bottom Layer w0.158: v1(45.94,13.44) 50.63,13.44 v1(54.54,17.34)
STRIP1: length 29.4
  Top Layer w0.158: v1(45.21,22.73) 45.21,18.03 46.4,16.84 47,16.84 ; v1(49.53,31.75) 50.09,32.52
  Bottom Layer w0.158: LEDH1.3 56.51,36.44 v1(49.53,31.75) 49.53,27.55 45.21,23.24 v1(45.21,22.73)
STRIP2: length 35.4
  Top Layer w0.158: R4.1 v1(48.25,32.25) ; v1(43.56,23.62) 43.56,17.78 46.19,15.14 U1.34
  Bottom Layer w0.158: v1(43.56,23.62) 48.25,28.32 v1(48.25,32.25) 55.21,37.18 55.34,40.36 LEDH1.4
TX: length 43.1
  Top Layer w0.158: v1(51.18,20.7) 49.87,19.39 U1.39
  Bottom Layer w0.158: GPIOH1.2 74.8,45.08 72,44.95 67.1,41.89 59.56,34.54 59.56,29.08 v1(51.18,20.7)
USB_D+: length 2.9
  Top Layer w0.147: U1.24 40.85,10.99 40.6,10.74 40.6,10.71 40.62,10.69 40.49,9.84 40.49,9.71 R8.2
USB_D-: length 2.9
  Top Layer w0.147: R9.2 40.14,9.71 40.14,9.86 40.25,10.59 40.25,10.74 40,10.99 U1.23
USB_DN_CONN: length 4.6
  Top Layer w0.147: R9.1 40.04,8.2 40.14,8.09 40.14,7.95 40.32,7.48 40.32,7.33 40.25,7.26 USB1.7 40.22,6.56 40.22,6.71 40.13,6.81 40.13,7.11 arc(40.06,7.27) 39.9,7.34 39.6,7.34 arc(39.44,7.27) 39.37,7.11 39.37,6.56 USB1.5
USB_DP_CONN: length 4.7
  Top Layer w0.147: R8.1 40.6,8.2 40.49,8.09 40.49,8.01 40.62,7.68 40.68,7.63 40.68,7.33 40.75,7.26 USB1.8 40.63,6.56 40.63,6.01 arc(40.56,5.85) 40.4,5.79 40.1,5.79 arc(39.94,5.85) 39.87,6.01 39.87,6.56 USB1.6
VLED: length 21.2
  Top Layer w0.762: SW3.3 46.44,41.56 arc(46.42,41.39) 46.43,41.21 46.38,36.33 49.57,34.45 50.79,33.79 53.97,35.81 LEDH1.1
  Top Layer w0.813: LEDH1.1 LEDH1.2
XGPA0: length 7.3
  Top Layer w0.158: SWH1.1 62.9,13.77 EXT1.17
XGPA1: length 4.4
  Top Layer w0.158: SWH1.2 62.19,15.4 EXT1.18
XGPA2: length 7.6
  Top Layer w0.158: SWH1.3 64.68,15.71 63.87,16.53 61.98,16.53 EXT1.19
XGPA3: length 4.7
  Top Layer w0.158: EXT1.20 62.08,17.34 65.02,17.34
XGPA4: length 7.8
  Top Layer w0.158: 68.6,17.66 66.31,17.66 64.94,19.02 EXT1.21
XGPA5: length 5.8
  Top Layer w0.158: SWH1.6 65.61,20.34 EXT1.22
XGPA6: length 10.1
  Top Layer w0.158: 70.23,19.6 67.88,19.6 66.37,21.11 61.18,21.11 EXT1.23
XGPA7: length 8.4
  Top Layer w0.158: EXT1.24 60.99,21.84 67.69,21.84 SWH1.8
XGPB0: length 13.8
  Top Layer w0.158: EXT1.25 60.83,22.6 71.37,22.6 SWH2.1 72.78,24.05
XGPB1: length 12
  Top Layer w0.158: SWH2.2 68.87,23.36 60.67,23.36 EXT1.26
XGPB2: length 16.2
  Top Layer w0.158: EXT1.27 60.64,24.25 68.07,24.25 69.97,26.16 73.41,26.16 73.65,26.4 73.65,26.43
XGPB3: length 14.5
  Top Layer w0.158: SWH2.4 68.23,27.27 68.2,27.3 65.91,25.01 60.48,25.01 58.56,23.09
XGPB4: length 19.7
  Top Layer w0.158: 74.52,28.84 SWH2.5 74.17,28.44 67.95,28.44 67.95,28.45 65.4,25.9 60.06,25.9 EXT1.1
XGPB5: length 19.3
  Top Layer w0.158: EXT1.2 56.48,22.95 56.48,23.42 60.1,27.05 64.76,27.05 67.41,29.69 67.44,29.66 SWH2.6 72.03,29.55
XGPB6: length 24.5
  Top Layer w0.158: 75.39,31.33 75.39,31.17 75.07,30.86 66.67,30.86 63.88,28.06 59.94,28.06 56.02,24.14 56.02,22.49 EXT1.3
XGPB7: length 24.8
  Top Layer w0.158: SWH2.8 72.31,32.74 63.09,32.74 55.11,24.76 55.11,22.47 EXT1.4
YGPA0: length 25.8
  Top Layer w0.158: SWH4.7 18.62,32.04 25.65,25.01 25.65,22.32 EXT2.17
YGPA1: length 26.1
  Top Layer w0.158: EXT2.18 24.89,22.47 24.89,24.38 18.42,30.85 4.94,30.85 4.61,31.17
YGPA2: length 20.5
  Top Layer w0.158: SWH4.5 18.47,29.66 23.98,24.14 23.98,22.49 EXT2.19
YGPA3: length 21.2
  Top Layer w0.158: EXT2.20 23.52,22.95 23.52,23.42 18.47,28.47 5.8,28.47 SWH4.6
YGPA4: length 15.7
  Top Layer w0.158: SWH4.3 18.57,27.27 EXT2.21
YGPA5: length 16.4
  Top Layer w0.158: 6.35,26.4 8.17,26.35 arc(8.44,26.23) 8.74,26.19 arc(9,26.22) 9.25,26.32 13.74,26.19 18.34,26.19 21.44,23.09
YGPA6: length 12.3
  Top Layer w0.158: SWH4.1 18.73,24.88 EXT2.23
YGPA7: length 14.1
  Top Layer w0.158: SWH4.2 7.67,23.56 19.13,23.56 EXT2.24
YGPB0: length 9.4
  Top Layer w0.158: EXT2.25 19.04,22.73 13.2,22.73 SWH3.7
YGPB1: length 11
  Top Layer w0.158: 9.77,19.6 12.12,19.6 14.36,21.84 19.01,21.84 EXT2.26
YGPB2: length 6.6
  Top Layer w0.158: EXT2.27 18.94,20.99 15.05,20.99 SWH3.5
YGPB3: length 8.4
  Top Layer w0.158: EXT2.28 18.15,19.81 15.79,19.81 13.64,17.66 11.4,17.66
YGPB4: length 4.4
  Top Layer w0.158: EXT2.1 18.45,18.79 16.42,18.79 14.98,17.34
YGPB5: length 7.3
  Top Layer w0.158: SWH3.4 14.95,15.71 17.14,17.9 18.48,17.9 EXT2.2
YGPB6: length 4.1
  Top Layer w0.158: SWH3.1 16.89,15.4 EXT2.3
YGPB7: length 7.4
  Top Layer w0.158: SWH3.2 16.94,13.77 19.43,16.25 19.43,17.01 EXT2.4
$10N280: length 1.9
  Top Layer w0.254: 38.75,6.81 38.75,7.77 38.53,8 37.89,8
$10N292: length 2
  Top Layer w0.254: 42.62,8.12 41.98,8.12 41.75,7.89 41.75,6.81
$12N1424: length 2.9
  Top Layer w0.305: 30.88,35.96 30.88,38.65 R1.2
$12N1491: length 2.2
  Top Layer w0.305: U5.16 31.63,38.22 R2.2
$12N6220: length 2.5
  Top Layer w0.305: 33.75,35.96 34.98,35.96 35.86,36.84 35.86,36.86

## Copper pours and planes (outline as drawn; the poured copper is in the pictures)
3V3 on Top Layer: 78.86,40.34 78.82,41.54 78.74,42.74 78.63,43.93 78.48,45.11 78.29,46.3 78.07,47.47 77.81,48.64 77.51,49.8 77.18,50.95 76.81,52.09 76.4,53.21 75.96,54.33 75.49,55.42 74.98,56.51 74.43,57.57 73.86,58.62 73.25,59.65 72.61,60.66 71.93,61.65 71.23,62.62 70.5,63.57 69.73,64.49 68.94,65.39 68.12,66.26 67.28,67.11 66.4,67.93 65.51,68.72 64.58,69.48 63.64,70.21 62.67,70.92 61.68,71.59 60.67,72.23 59.64,72.84 58.59,73.42 57.52,73.96 56.44,74.47 55.34,74.95 54.23,75.39 53.1,75.79 51.96,76.16 50.82,76.5 49.66,76.79 48.49,77.05 47.31,77.28 46.13,77.47 44.94,77.62 43.75,77.73 42.56,77.8 41.36,77.84 40.16,77.84 38.97,77.8 37.77,77.73 36.58,77.62 35.39,77.47 34.21,77.28 33.04,77.05 31.87,76.79 30.71,76.5 29.56,76.16 28.42,75.79 27.29,75.39 26.18,74.95 25.08,74.47 24,73.96 22.93,73.42 21.89,72.84 20.85,72.23 19.84,71.59 18.85,70.92 17.89,70.21 16.94,69.48 16.02,68.72 15.12,67.93 14.25,67.11 13.4,66.26 12.58,65.39 11.79,64.49 11.03,63.57 10.29,62.62 9.59,61.65 8.92,60.66 8.28,59.65 7.67,58.62 7.09,57.57 6.55,56.51 6.04,55.42 5.56,54.33 5.12,53.21 4.72,52.09 4.35,50.95 4.01,49.8 3.71,48.64 3.45,47.47 3.23,46.3 3.04,45.11 2.89,43.93 2.78,42.74 2.7,41.54 2.67,40.34 2.67,39.15 2.7,37.95 2.78,36.76 2.89,35.57 3.04,34.38 3.23,33.2 3.45,32.02 3.71,30.85 4.01,29.69 4.35,28.54 4.72,27.4 5.12,26.28 5.56,25.17 6.04,24.07 6.55,22.98 7.09,21.92 7.67,20.87 8.28,19.84 8.92,18.83 9.59,17.84 10.29,16.87 11.03,15.92 11.79,15 12.58,14.1 13.4,13.23 14.25,12.39 15.12,11.57 16.02,10.77 16.94,10.01 17.89,9.28 18.85,8.57 19.84,7.9 20.85,7.26 21.89,6.65 22.93,6.07 24,5.53 25.08,5.02 26.18,4.55 27.29,4.11 28.42,3.7 29.56,3.33 30.71,3 31.87,2.7 33.04,2.44 34.21,2.21 35.39,2.03 36.58,1.88 37.77,1.76 38.97,1.69 40.16,1.65 41.36,1.65 42.56,1.69 43.75,1.76 44.94,1.88 46.13,2.03 47.31,2.21 48.49,2.44 49.66,2.7 50.82,3 51.96,3.33 53.1,3.7 54.23,4.11 55.34,4.55 56.44,5.02 57.52,5.53 58.59,6.07 59.64,6.65 60.67,7.26 61.68,7.9 62.67,8.57 63.64,9.28 64.58,10.01 65.51,10.77 66.4,11.57 67.28,12.39 68.12,13.23 68.94,14.1 69.73,15 70.5,15.92 71.23,16.87 71.93,17.84 72.61,18.83 73.25,19.84 73.86,20.87 74.43,21.92 74.98,22.98 75.49,24.07 75.96,25.17 76.4,26.28 76.81,27.4 77.18,28.54 77.51,29.69 77.81,30.85 78.07,32.02 78.29,33.2 78.48,34.38 78.63,35.57 78.74,36.76 78.82,37.95 78.86,39.15
GND on Inner1: 26.3,76.05 27.45,76.05 27.45,74.8 26.3,74.8
GND on Inner1: 37.11,62.86 38.39,62.86 38.39,61.84 37.11,61.84
GND on Inner1: 44.73,62.86 46.01,62.86 46.01,61.84 44.73,61.84
GND on Inner1: 58.17,70.54 59.32,70.54 59.32,69.3 58.17,69.3
GND on Inner1: 43.3,61.43 44.32,61.43 44.32,60.15 43.3,60.15
GND on Inner1: 39.07,65.4 40.35,65.4 40.35,64.38 39.07,64.38
GND on Inner1: 25.08,73.08 26.23,73.08 26.23,71.84 25.08,71.84
GND on Inner1: 18.77,68.77 19.92,68.77 19.92,67.52 18.77,67.52
GND on Inner1: 59.46,70.85 60.7,70.85 60.7,69.71 59.46,69.71
GND on Inner1: 53.79,71.19 55.03,71.19 55.03,70.05 53.79,70.05
GND on Inner1: 25.39,74.37 26.63,74.37 26.63,73.22 25.39,73.22
GND on Inner1: 26.66,72.17 27.9,72.17 27.9,71.02 26.66,71.02
GND on Inner1: 26.79,67.12 27.81,67.12 27.81,65.84 26.79,65.84
GND on Inner1: 58.7,68.36 59.94,68.36 59.94,67.21 58.7,67.21
GND on Inner1: 40.76,63.97 41.78,63.97 41.78,62.69 40.76,62.69
GND on Inner1: 45.72,50.02 46.73,50.02 46.73,48.74 45.72,48.74
GND on Inner1: 32.03,60.32 33.31,60.32 33.31,59.3 32.03,59.3
GND on Inner1: 18.37,67.38 19.61,67.38 19.61,66.24 18.37,66.24
GND on Inner1: 56.9,68.34 58.05,68.34 58.05,67.1 56.9,67.1
GND on Inner1: 43.82,3.48 44.83,3.48 44.83,2.2 43.82,2.2
GND on Inner1: 42.19,60.32 43.47,60.32 43.47,59.3 42.19,59.3
GND on Inner1: 44.73,65.4 46.01,65.4 46.01,64.38 44.73,64.38
GND on Inner1: 69.8,53.65 70.82,53.65 70.82,52.37 69.8,52.37
GND on Inner1: 35.68,63.97 36.7,63.97 36.7,62.69 35.68,62.69
GND on Inner1: 46.69,60.32 47.97,60.32 47.97,59.3 46.69,59.3
GND on Inner1: 39.65,65.4 40.93,65.4 40.93,64.38 39.65,64.38
GND on Inner1: 56.95,73.51 58.1,73.51 58.1,72.26 56.95,72.26
GND on Inner1: 19.3,70.85 20.54,70.85 20.54,69.71 19.3,69.71
GND on Inner1: 42.19,65.4 43.47,65.4 43.47,64.38 42.19,64.38
GND on Inner1: 34.57,60.32 35.85,60.32 35.85,59.3 34.57,59.3
GND on Inner1: 55.57,73.1 56.81,73.1 56.81,71.95 55.57,71.95
GND on Inner1: 21.95,68.34 23.1,68.34 23.1,67.1 21.95,67.1
GND on Inner1: 43.85,75.51 45.13,75.51 45.13,74.49 43.85,74.49
GND on Inner1: 37.11,67.94 38.39,67.94 38.39,66.92 37.11,66.92
GND on Inner1: 24.46,70.9 25.7,70.9 25.7,69.75 24.46,69.75
GND on Inner1: 57.88,70.04 59.03,70.04 59.03,68.79 57.88,68.79
GND on Inner1: 38.22,63.97 39.24,63.97 39.24,62.69 38.22,62.69
GND on Inner1: 45.84,66.51 46.86,66.51 46.86,65.23 45.84,65.23
GND on Inner1: 34.54,50.31 35.56,50.31 35.56,49.03 34.54,49.03
GND on Inner1: 26.35,70.88 27.5,70.88 27.5,69.64 26.35,69.64
GND on Inner1: 20.57,68.65 21.81,68.65 21.81,67.51 20.57,67.51
GND on Inner1: 57.77,71.83 59.01,71.83 59.01,70.68 57.77,70.68
GND on Inner1: 31.15,62.5 32.43,62.5 32.43,61.49 31.15,61.49
GND on Inner1: 63.63,31.97 64.91,31.97 64.91,30.96 63.63,30.96
GND on Inner1: 23.7,73.39 24.94,73.39 24.94,72.25 23.7,72.25
GND on Inner1: 33.14,61.43 34.16,61.43 34.16,60.15 33.14,60.15
GND on Inner1: 54.75,74.78 55.9,74.78 55.9,73.53 54.75,73.53
GND on Inner1: 64.89,30.98 65.91,30.98 65.91,29.7 64.89,29.7
GND on Inner1: 59.39,41.78 60.67,41.78 60.67,40.76 59.39,40.76
GND on Inner1: 59.15,72.24 60.3,72.24 60.3,70.99 59.15,70.99
GND on Inner1: 17.55,65.8 18.7,65.8 18.7,64.56 17.55,64.56
GND on Inner1: 44.36,6.52 45.64,6.52 45.64,5.5 44.36,5.5
GND on Inner1: 52.5,70.88 53.65,70.88 53.65,69.64 52.5,69.64
GND on Inner1: 34.87,75.51 36.15,75.51 36.15,74.49 34.87,74.49
GND on Inner1: 4.65,37.97 5.93,37.97 5.93,36.95 4.65,36.95
GND on Inner1: 16.28,68 17.43,68 17.43,66.76 16.28,66.76
GND on Inner1: 62.17,69.29 63.41,69.29 63.41,68.14 62.17,68.14
GND on Inner1: 57.26,72.12 58.5,72.12 58.5,70.98 57.26,70.98
GND on Inner1: 20.97,70.04 22.12,70.04 22.12,68.79 20.97,68.79
GND on Inner1: 51.59,72.46 52.83,72.46 52.83,71.32 51.59,71.32
GND on Inner1: 38.22,62.02 39.24,62.02 39.24,60.73 38.22,60.73
GND on Inner1: 39.07,62.86 40.35,62.86 40.35,61.84 39.07,61.84
GND on Inner1: 46.71,48.76 47.99,48.76 47.99,47.75 46.71,47.75
GND on Inner1: 22.88,71.81 24.03,71.81 24.03,70.57 22.88,70.57
GND on Inner1: 4.56,58.01 5.84,58.01 5.84,56.99 4.56,56.99
GND on Inner1: 58.54,40.35 59.56,40.35 59.56,39.07 58.54,39.07
GND on Inner1: 39.65,62.86 40.93,62.86 40.93,61.84 39.65,61.84
GND on Inner1: 43.3,66.51 44.32,66.51 44.32,65.23 43.3,65.23
GND on Inner1: 62.28,67.5 63.43,67.5 63.43,66.25 62.28,66.25
GND on Inner1: 33.14,66.51 34.16,66.51 34.16,65.23 33.14,65.23
GND on Inner1: 0.26,79.75 79.74,79.75 79.74,0.25 0.26,0.25
GND on Inner1: 54.3,70.9 55.54,70.9 55.54,69.75 54.3,69.75
GND on Inner1: 37.11,60.32 38.39,60.32 38.39,59.3 37.11,59.3
GND on Inner1: 36.53,67.94 37.81,67.94 37.81,66.92 36.53,66.92
GND on Inner1: 45.84,63.97 46.86,63.97 46.86,62.69 45.84,62.69
GND on Inner1: 27.28,74.35 28.43,74.35 28.43,73.11 27.28,73.11
GND on Inner1: 61.35,70.97 62.5,70.97 62.5,69.72 61.35,69.72
GND on Inner1: 59.1,67.07 60.25,67.07 60.25,65.83 59.1,65.83
GND on Inner1: 3.22,37.12 4.24,37.12 4.24,35.84 3.22,35.84
GND on Inner1: 17.86,67.09 19.1,67.09 19.1,65.94 17.86,65.94
GND on Inner1: 32.03,65.4 33.31,65.4 33.31,64.38 32.03,64.38
GND on Inner1: 60.39,67.38 61.63,67.38 61.63,66.24 60.39,66.24
GND on Inner1: 37.11,65.4 38.39,65.4 38.39,64.38 37.11,64.38
GND on Inner1: 59.39,39.24 60.67,39.24 60.67,38.22 59.39,38.22
GND on Inner1: 38.22,66.51 39.24,66.51 39.24,65.23 38.22,65.23
GND on Inner1: 60.9,67.09 62.14,67.09 62.14,65.94 60.9,65.94
GND on Inner1: 74.16,58.01 75.44,58.01 75.44,56.99 74.16,56.99
GND on Inner1: 23.17,71.31 24.32,71.31 24.32,70.06 23.17,70.06
GND on Inner1: 27.17,72.46 28.41,72.46 28.41,71.32 27.17,71.32
GND on Inner1: 5.76,37.12 6.78,37.12 6.78,35.84 5.76,35.84
GND on Inner1: 35.68,59.48 36.7,59.48 36.7,58.19 35.68,58.19
GND on Inner1: 35.53,51.3 36.81,51.3 36.81,50.29 35.53,50.29
GND on Inner1: 52.55,76.05 53.7,76.05 53.7,74.8 52.55,74.8
GND on Inner1: 60.08,68.77 61.23,68.77 61.23,67.52 60.08,67.52
GND on Inner1: 34.31,2.32 35.59,2.32 35.59,1.3 34.31,1.3
GND on Inner1: 58.54,40.93 59.56,40.93 59.56,39.65 58.54,39.65
GND on Inner1: 44.73,67.94 46.01,67.94 46.01,66.92 44.73,66.92
GND on Inner1: 44.15,62.86 45.43,62.86 45.43,61.84 44.15,61.84
GND on Inner1: 40.76,61.43 41.78,61.43 41.78,60.15 40.76,60.15
GND on Inner1: 21.5,72.12 22.74,72.12 22.74,70.98 21.5,70.98
GND on Inner1: 60.37,69.27 61.52,69.27 61.52,68.03 60.37,68.03
GND on Inner1: 49.9,73.44 51.14,73.44 51.14,72.29 49.9,72.29
GND on Inner1: 38.22,61.43 39.24,61.43 39.24,60.15 38.22,60.15
GND on Inner1: 41.61,60.32 42.89,60.32 42.89,59.3 41.61,59.3
GND on Inner1: 17.5,70.97 18.65,70.97 18.65,69.72 17.5,69.72
GND on Inner1: 39.65,60.32 40.93,60.32 40.93,59.3 39.65,59.3
GND on Inner1: 16.17,66.11 17.41,66.11 17.41,64.97 16.17,64.97
GND on Inner1: 39.49,71.15 40.51,71.15 40.51,69.87 39.49,69.87
GND on Inner1: 36.53,65.4 37.81,65.4 37.81,64.38 36.53,64.38
GND on Inner1: 19.7,72.24 20.85,72.24 20.85,70.99 19.7,70.99
GND on Inner1: 28.55,72.15 29.7,72.15 29.7,70.91 28.55,70.91
GND on Inner1: 23.19,73.1 24.43,73.1 24.43,71.95 23.19,71.95
GND on Inner1: 39.07,60.32 40.35,60.32 40.35,59.3 39.07,59.3
GND on Inner1: 42.19,62.86 43.47,62.86 43.47,61.84 42.19,61.84
GND on Inner1: 55.68,71.31 56.83,71.31 56.83,70.06 55.68,70.06
GND on Inner1: 41.61,65.4 42.89,65.4 42.89,64.38 41.61,64.38
GND on Inner1: 35.17,5.52 36.18,5.52 36.18,4.24 35.17,4.24
GND on Inner1: 43.3,59.48 44.32,59.48 44.32,58.19 43.3,58.19
GND on Inner1: 24.97,71.19 26.21,71.19 26.21,70.05 24.97,70.05
GND on Inner1: 16.59,69.29 17.83,69.29 17.83,68.14 16.59,68.14
GND on Inner1: 2.11,37.97 3.39,37.97 3.39,36.95 2.11,36.95
GND on Inner1: 32.03,67.94 33.31,67.94 33.31,66.92 32.03,66.92
GND on Inner1: 33.99,60.32 35.27,60.32 35.27,59.3 33.99,59.3
GND on Inner1: 45.84,67.1 46.86,67.1 46.86,65.81 45.84,65.81
GND on Inner1: 45.84,62.02 46.86,62.02 46.86,60.73 45.84,60.73
GND on Inner1: 33.14,64.56 34.16,64.56 34.16,63.27 33.14,63.27
GND on Inner1: 38.22,69.05 39.24,69.05 39.24,67.77 38.22,67.77
GND on Inner1: 36.53,60.32 37.81,60.32 37.81,59.3 36.53,59.3
GND on Inner1: 38.22,67.1 39.24,67.1 39.24,65.81 38.22,65.81
GND on Inner1: 65.89,31.97 67.17,31.97 67.17,30.96 65.89,30.96
GND on Inner1: 40.76,67.1 41.78,67.1 41.78,65.81 40.76,65.81
GND on Inner1: 43.3,69.05 44.32,69.05 44.32,67.77 43.3,67.77
GND on Inner1: 35.68,69.05 36.7,69.05 36.7,67.77 35.68,67.77
GND on Inner1: 33.99,62.86 35.27,62.86 35.27,61.84 33.99,61.84
GND on Inner1: 38.22,64.56 39.24,64.56 39.24,63.27 38.22,63.27
GND on Inner1: 36.53,62.86 37.81,62.86 37.81,61.84 36.53,61.84
GND on Inner1: 17.1,69.58 18.34,69.58 18.34,68.44 17.1,68.44
GND on Inner1: 43.3,64.56 44.32,64.56 44.32,63.27 43.3,63.27
GND on Inner1: 52.19,67.12 53.21,67.12 53.21,65.84 52.19,65.84
GND on Inner1: 9.18,53.65 10.2,53.65 10.2,52.37 9.18,52.37
GND on Inner1: 34.36,6.52 35.64,6.52 35.64,5.5 34.36,5.5
GND on Inner1: 45.84,61.43 46.86,61.43 46.86,60.15 45.84,60.15
GND on Inner1: 56.55,62.5 57.83,62.5 57.83,61.49 56.55,61.49
GND on Inner1: 34.57,67.94 35.85,67.94 35.85,66.92 34.57,66.92
GND on Inner1: 33.99,65.4 35.27,65.4 35.27,64.38 33.99,64.38
GND on Inner1: 45.72,47.77 46.73,47.77 46.73,46.49 45.72,46.49
GND on Inner1: 26.79,58.15 27.81,58.15 27.81,56.87 26.79,56.87
GND on Inner1: 35.76,2.32 37.04,2.32 37.04,1.3 35.76,1.3
GND on Inner1: 38.22,59.48 39.24,59.48 39.24,58.19 38.22,58.19
GND on Inner1: 9.18,62.63 10.2,62.63 10.2,61.35 9.18,61.35
GND on Inner1: 35.17,3.48 36.18,3.48 36.18,2.2 35.17,2.2
GND on Inner1: 65.19,58.01 66.47,58.01 66.47,56.99 65.19,56.99
GND on Inner1: 4.07,37.97 5.35,37.97 5.35,36.95 4.07,36.95
GND on Inner1: 51.57,74.35 52.72,74.35 52.72,73.11 51.57,73.11
GND on Inner1: 16.57,67.5 17.72,67.5 17.72,66.25 16.57,66.25
GND on Inner1: 40.76,66.51 41.78,66.51 41.78,65.23 40.76,65.23
GND on Inner1: 52.19,58.15 53.21,58.15 53.21,56.87 52.19,56.87
GND on Inner1: 35.68,64.56 36.7,64.56 36.7,63.27 35.68,63.27
GND on Inner1: 22.26,69.63 23.5,69.63 23.5,68.48 22.26,68.48
GND on Inner1: 51.17,75.64 52.41,75.64 52.41,74.49 51.17,74.49
GND on Inner1: 63.86,68.31 65.1,68.31 65.1,67.17 63.86,67.17
GND on Inner1: 39.07,67.94 40.35,67.94 40.35,66.92 39.07,66.92
GND on Inner1: 45.84,59.48 46.86,59.48 46.86,58.19 45.84,58.19
GND on Inner1: 59.97,70.56 61.21,70.56 61.21,69.41 59.97,69.41
GND on Inner1: 46.69,62.86 47.97,62.86 47.97,61.84 46.69,61.84
GND on Inner1: 61.3,65.8 62.45,65.8 62.45,64.56 61.3,64.56
GND on Inner1: 33.14,67.1 34.16,67.1 34.16,65.81 33.14,65.81
GND on Inner1: 42.19,67.94 43.47,67.94 43.47,66.92 42.19,66.92
GND on Inner1: 58.19,68.65 59.43,68.65 59.43,67.51 58.19,67.51
GND on Inner1: 34.54,52.56 35.56,52.56 35.56,51.28 34.54,51.28
GND on Inner1: 27.57,73.85 28.72,73.85 28.72,72.6 27.57,72.6
GND on Inner1: 43.3,67.1 44.32,67.1 44.32,65.81 43.3,65.81
GND on Inner1: 14.9,68.31 16.14,68.31 16.14,67.17 14.9,67.17
GND on Inner1: 47.57,62.5 48.85,62.5 48.85,61.49 47.57,61.49
GND on Inner1: 35.17,7.78 36.18,7.78 36.18,6.5 35.17,6.5
GND on Inner1: 13.53,58.01 14.81,58.01 14.81,56.99 13.53,56.99
GND on Inner1: 56.5,69.63 57.74,69.63 57.74,68.48 56.5,68.48
GND on Inner1: 53.48,72.58 54.63,72.58 54.63,71.33 53.48,71.33
GND on Inner1: 33.99,67.94 35.27,67.94 35.27,66.92 33.99,66.92
GND on Inner1: 44.15,60.32 45.43,60.32 45.43,59.3 44.15,59.3
GND on Inner1: 52.1,72.17 53.34,72.17 53.34,71.02 52.1,71.02
GND on Inner1: 35.68,67.1 36.7,67.1 36.7,65.81 35.68,65.81
GND on Inner1: 15.3,69.7 16.45,69.7 16.45,68.45 15.3,68.45
GND on Inner1: 33.14,63.97 34.16,63.97 34.16,62.69 33.14,62.69
GND on Inner1: 20.68,70.54 21.83,70.54 21.83,69.3 20.68,69.3
GND on Inner1: 63.55,69.7 64.7,69.7 64.7,68.45 63.55,68.45
GND on Inner1: 62.59,66.11 63.83,66.11 63.83,64.97 62.59,64.97
GND on Inner1: 52.86,74.66 54.1,74.66 54.1,73.52 52.86,73.52
GND on Inner1: 33.14,69.05 34.16,69.05 34.16,67.77 33.14,67.77
GND on Inner1: 20.99,71.83 22.23,71.83 22.23,70.68 20.99,70.68
GND on Inner1: 43.82,5.52 44.83,5.52 44.83,4.24 43.82,4.24
GND on Inner1: 24.1,74.78 25.25,74.78 25.25,73.53 24.1,73.53
GND on Inner1: 54.7,69.61 55.85,69.61 55.85,68.37 54.7,68.37
GND on Inner1: 61.66,69.58 62.9,69.58 62.9,68.44 61.66,68.44
GND on Inner1: 69.8,62.63 70.82,62.63 70.82,61.35 69.8,61.35
GND on Inner1: 53.37,74.37 54.61,74.37 54.61,73.22 53.37,73.22
GND on Inner1: 40.76,62.02 41.78,62.02 41.78,60.73 40.76,60.73
GND on Inner1: 41.61,62.86 42.89,62.86 42.89,61.84 41.61,61.84
GND on Inner1: 58.54,42.89 59.56,42.89 59.56,41.61 58.54,41.61
GND on Inner1: 46.69,65.4 47.97,65.4 47.97,64.38 46.69,64.38
GND on Inner1: 25.9,74.66 27.14,74.66 27.14,73.52 25.9,73.52
GND on Inner1: 19.75,67.07 20.9,67.07 20.9,65.83 19.75,65.83
GND on Inner1: 40.76,59.48 41.78,59.48 41.78,58.19 40.76,58.19
GND on Inner1: 39.65,67.94 40.93,67.94 40.93,66.92 39.65,66.92
GND on Inner1: 41.61,67.94 42.89,67.94 42.89,66.92 41.61,66.92
GND on Inner1: 44.15,67.94 45.43,67.94 45.43,66.92 44.15,66.92
GND on Inner1: 35.68,62.02 36.7,62.02 36.7,60.73 35.68,60.73
GND on Inner1: 44.15,65.4 45.43,65.4 45.43,64.38 44.15,64.38
GND on Inner1: 24.15,69.61 25.3,69.61 25.3,68.37 24.15,68.37
GND on Inner1: 55.06,73.39 56.3,73.39 56.3,72.25 55.06,72.25
GND on Inner1: 55.99,69.92 57.23,69.92 57.23,68.78 55.99,68.78
GND on Inner1: 33.14,59.48 34.16,59.48 34.16,58.19 33.14,58.19
GND on Inner1: 45.84,64.56 46.86,64.56 46.86,63.27 45.84,63.27
GND on Inner1: 25.37,72.58 26.52,72.58 26.52,71.33 25.37,71.33
GND on Inner1: 50.3,72.15 51.45,72.15 51.45,70.91 50.3,70.91
GND on Inner1: 44.73,60.32 46.01,60.32 46.01,59.3 44.73,59.3
GND on Inner1: 45.84,69.05 46.86,69.05 46.86,67.77 45.84,67.77
GND on Inner1: 40.76,69.05 41.78,69.05 41.78,67.77 40.76,67.77
GND on Inner1: 18.48,69.27 19.63,69.27 19.63,68.03 18.48,68.03
GND on Inner1: 43.3,62.02 44.32,62.02 44.32,60.73 43.3,60.73
GND on Inner1: 42.96,2.32 44.24,2.32 44.24,1.3 42.96,1.3
GND on Inner1: 32.03,62.86 33.31,62.86 33.31,61.84 32.03,61.84
GND on Inner1: 43.82,7.78 44.83,7.78 44.83,6.5 43.82,6.5
GND on Inner1: 35.68,61.43 36.7,61.43 36.7,60.15 35.68,60.15
GND on Inner1: 21.9,73.51 23.05,73.51 23.05,72.26 21.9,72.26
GND on Inner1: 34.57,65.4 35.85,65.4 35.85,64.38 34.57,64.38
GND on Inner1: 58.54,38.39 59.56,38.39 59.56,37.11 58.54,37.11
GND on Inner1: 40.76,64.56 41.78,64.56 41.78,63.27 40.76,63.27
GND on Inner1: 53.77,73.08 54.92,73.08 54.92,71.84 53.77,71.84
GND on Inner1: 43.3,63.97 44.32,63.97 44.32,62.69 43.3,62.69
GND on Inner1: 28.86,73.44 30.1,73.44 30.1,72.29 28.86,72.29
GND on Inner1: 22.17,62.5 23.45,62.5 23.45,61.49 22.17,61.49
GND on Inner1: 20.06,68.36 21.3,68.36 21.3,67.21 20.06,67.21
GND on Inner1: 44.41,2.32 45.69,2.32 45.69,1.3 44.41,1.3
GND on Inner1: 27.59,75.64 28.83,75.64 28.83,74.49 27.59,74.49
GND on Inner1: 35.68,66.51 36.7,66.51 36.7,65.23 35.68,65.23
GND on Inner1: 6.61,37.97 7.89,37.97 7.89,36.95 6.61,36.95
GND on Inner1: 62.57,68 63.72,68 63.72,66.76 62.57,66.76
GND on Inner1: 51.28,73.85 52.43,73.85 52.43,72.6 51.28,72.6
GND on Inner1: 18.79,70.56 20.03,70.56 20.03,69.41 18.79,69.41
GND on Inner1: 33.14,62.02 34.16,62.02 34.16,60.73 33.14,60.73
GND on Inner1: 22.77,69.92 24.01,69.92 24.01,68.78 22.77,68.78
GND on Inner1: 46.69,67.94 47.97,67.94 47.97,66.92 46.69,66.92
GND on Inner1: 34.57,62.86 35.85,62.86 35.85,61.84 34.57,61.84
GND on Inner1: 55.97,71.81 57.12,71.81 57.12,70.57 55.97,70.57
GND on Inner2: 43.82,5.52 44.83,5.52 44.83,4.24 43.82,4.24
GND on Inner2: 37.11,60.32 38.39,60.32 38.39,59.3 37.11,59.3
GND on Inner2: 61.3,65.8 62.45,65.8 62.45,64.56 61.3,64.56
GND on Inner2: 39.49,71.15 40.51,71.15 40.51,69.87 39.49,69.87
GND on Inner2: 2.11,37.97 3.39,37.97 3.39,36.95 2.11,36.95
GND on Inner2: 63.63,31.97 64.91,31.97 64.91,30.96 63.63,30.96
GND on Inner2: 27.59,75.64 28.83,75.64 28.83,74.49 27.59,74.49
GND on Inner2: 33.14,69.05 34.16,69.05 34.16,67.77 33.14,67.77
GND on Inner2: 35.68,66.51 36.7,66.51 36.7,65.23 35.68,65.23
GND on Inner2: 35.68,63.97 36.7,63.97 36.7,62.69 35.68,62.69
GND on Inner2: 26.35,70.88 27.5,70.88 27.5,69.64 26.35,69.64
GND on Inner2: 24.46,70.9 25.7,70.9 25.7,69.75 24.46,69.75
GND on Inner2: 38.22,66.51 39.24,66.51 39.24,65.23 38.22,65.23
GND on Inner2: 34.36,6.52 35.64,6.52 35.64,5.5 34.36,5.5
GND on Inner2: 58.54,40.35 59.56,40.35 59.56,39.07 58.54,39.07
GND on Inner2: 39.07,67.94 40.35,67.94 40.35,66.92 39.07,66.92
GND on Inner2: 54.7,69.61 55.85,69.61 55.85,68.37 54.7,68.37
GND on Inner2: 53.48,72.58 54.63,72.58 54.63,71.33 53.48,71.33
GND on Inner2: 17.86,67.09 19.1,67.09 19.1,65.94 17.86,65.94
GND on Inner2: 52.1,72.17 53.34,72.17 53.34,71.02 52.1,71.02
GND on Inner2: 27.17,72.46 28.41,72.46 28.41,71.32 27.17,71.32
GND on Inner2: 62.57,68 63.72,68 63.72,66.76 62.57,66.76
GND on Inner2: 35.68,62.02 36.7,62.02 36.7,60.73 35.68,60.73
GND on Inner2: 9.18,53.65 10.2,53.65 10.2,52.37 9.18,52.37
GND on Inner2: 58.7,68.36 59.94,68.36 59.94,67.21 58.7,67.21
GND on Inner2: 18.79,70.56 20.03,70.56 20.03,69.41 18.79,69.41
GND on Inner2: 20.68,70.54 21.83,70.54 21.83,69.3 20.68,69.3
GND on Inner2: 58.54,38.39 59.56,38.39 59.56,37.11 58.54,37.11
GND on Inner2: 27.57,73.85 28.72,73.85 28.72,72.6 27.57,72.6
GND on Inner2: 40.76,64.56 41.78,64.56 41.78,63.27 40.76,63.27
GND on Inner2: 44.15,60.32 45.43,60.32 45.43,59.3 44.15,59.3
GND on Inner2: 33.14,62.02 34.16,62.02 34.16,60.73 33.14,60.73
GND on Inner2: 44.73,60.32 46.01,60.32 46.01,59.3 44.73,59.3
GND on Inner2: 52.86,74.66 54.1,74.66 54.1,73.52 52.86,73.52
GND on Inner2: 28.55,72.15 29.7,72.15 29.7,70.91 28.55,70.91
GND on Inner2: 44.15,67.94 45.43,67.94 45.43,66.92 44.15,66.92
GND on Inner2: 22.77,69.92 24.01,69.92 24.01,68.78 22.77,68.78
GND on Inner2: 43.3,61.43 44.32,61.43 44.32,60.15 43.3,60.15
GND on Inner2: 43.3,64.56 44.32,64.56 44.32,63.27 43.3,63.27
GND on Inner2: 55.06,73.39 56.3,73.39 56.3,72.25 55.06,72.25
GND on Inner2: 50.3,72.15 51.45,72.15 51.45,70.91 50.3,70.91
GND on Inner2: 51.57,74.35 52.72,74.35 52.72,73.11 51.57,73.11
GND on Inner2: 45.84,62.02 46.86,62.02 46.86,60.73 45.84,60.73
GND on Inner2: 60.39,67.38 61.63,67.38 61.63,66.24 60.39,66.24
GND on Inner2: 9.18,62.63 10.2,62.63 10.2,61.35 9.18,61.35
GND on Inner2: 33.99,62.86 35.27,62.86 35.27,61.84 33.99,61.84
GND on Inner2: 25.9,74.66 27.14,74.66 27.14,73.52 25.9,73.52
GND on Inner2: 42.96,2.32 44.24,2.32 44.24,1.3 42.96,1.3
GND on Inner2: 40.76,63.97 41.78,63.97 41.78,62.69 40.76,62.69
GND on Inner2: 4.07,37.97 5.35,37.97 5.35,36.95 4.07,36.95
GND on Inner2: 46.69,67.94 47.97,67.94 47.97,66.92 46.69,66.92
GND on Inner2: 32.03,60.32 33.31,60.32 33.31,59.3 32.03,59.3
GND on Inner2: 42.19,67.94 43.47,67.94 43.47,66.92 42.19,66.92
GND on Inner2: 53.37,74.37 54.61,74.37 54.61,73.22 53.37,73.22
GND on Inner2: 32.03,65.4 33.31,65.4 33.31,64.38 32.03,64.38
GND on Inner2: 59.39,41.78 60.67,41.78 60.67,40.76 59.39,40.76
GND on Inner2: 20.57,68.65 21.81,68.65 21.81,67.51 20.57,67.51
GND on Inner2: 22.88,71.81 24.03,71.81 24.03,70.57 22.88,70.57
GND on Inner2: 35.17,7.78 36.18,7.78 36.18,6.5 35.17,6.5
GND on Inner2: 18.77,68.77 19.92,68.77 19.92,67.52 18.77,67.52
GND on Inner2: 47.57,62.5 48.85,62.5 48.85,61.49 47.57,61.49
GND on Inner2: 56.9,68.34 58.05,68.34 58.05,67.1 56.9,67.1
GND on Inner2: 21.5,72.12 22.74,72.12 22.74,70.98 21.5,70.98
GND on Inner2: 51.28,73.85 52.43,73.85 52.43,72.6 51.28,72.6
GND on Inner2: 43.3,62.02 44.32,62.02 44.32,60.73 43.3,60.73
GND on Inner2: 33.99,60.32 35.27,60.32 35.27,59.3 33.99,59.3
GND on Inner2: 14.9,68.31 16.14,68.31 16.14,67.17 14.9,67.17
GND on Inner2: 35.17,5.52 36.18,5.52 36.18,4.24 35.17,4.24
GND on Inner2: 64.89,30.98 65.91,30.98 65.91,29.7 64.89,29.7
GND on Inner2: 34.54,52.56 35.56,52.56 35.56,51.28 34.54,51.28
GND on Inner2: 62.59,66.11 63.83,66.11 63.83,64.97 62.59,64.97
GND on Inner2: 43.85,75.51 45.13,75.51 45.13,74.49 43.85,74.49
GND on Inner2: 55.97,71.81 57.12,71.81 57.12,70.57 55.97,70.57
GND on Inner2: 45.72,47.77 46.73,47.77 46.73,46.49 45.72,46.49
GND on Inner2: 41.61,65.4 42.89,65.4 42.89,64.38 41.61,64.38
GND on Inner2: 4.56,58.01 5.84,58.01 5.84,56.99 4.56,56.99
GND on Inner2: 19.3,70.85 20.54,70.85 20.54,69.71 19.3,69.71
GND on Inner2: 52.19,67.12 53.21,67.12 53.21,65.84 52.19,65.84
GND on Inner2: 69.8,62.63 70.82,62.63 70.82,61.35 69.8,61.35
GND on Inner2: 53.79,71.19 55.03,71.19 55.03,70.05 53.79,70.05
GND on Inner2: 28.86,73.44 30.1,73.44 30.1,72.29 28.86,72.29
GND on Inner2: 23.17,71.31 24.32,71.31 24.32,70.06 23.17,70.06
GND on Inner2: 43.82,3.48 44.83,3.48 44.83,2.2 43.82,2.2
GND on Inner2: 32.03,62.86 33.31,62.86 33.31,61.84 32.03,61.84
GND on Inner2: 21.9,73.51 23.05,73.51 23.05,72.26 21.9,72.26
GND on Inner2: 22.17,62.5 23.45,62.5 23.45,61.49 22.17,61.49
GND on Inner2: 60.08,68.77 61.23,68.77 61.23,67.52 60.08,67.52
GND on Inner2: 60.9,67.09 62.14,67.09 62.14,65.94 60.9,65.94
GND on Inner2: 44.36,6.52 45.64,6.52 45.64,5.5 44.36,5.5
GND on Inner2: 35.68,69.05 36.7,69.05 36.7,67.77 35.68,67.77
GND on Inner2: 61.66,69.58 62.9,69.58 62.9,68.44 61.66,68.44
GND on Inner2: 39.07,65.4 40.35,65.4 40.35,64.38 39.07,64.38
GND on Inner2: 35.17,3.48 36.18,3.48 36.18,2.2 35.17,2.2
GND on Inner2: 49.9,73.44 51.14,73.44 51.14,72.29 49.9,72.29
GND on Inner2: 0.26,79.75 79.74,79.75 79.74,0.25 0.26,0.25
GND on Inner2: 20.99,71.83 22.23,71.83 22.23,70.68 20.99,70.68
GND on Inner2: 63.86,68.31 65.1,68.31 65.1,67.17 63.86,67.17
GND on Inner2: 52.55,76.05 53.7,76.05 53.7,74.8 52.55,74.8
GND on Inner2: 40.76,69.05 41.78,69.05 41.78,67.77 40.76,67.77
GND on Inner2: 69.8,53.65 70.82,53.65 70.82,52.37 69.8,52.37
GND on Inner2: 52.5,70.88 53.65,70.88 53.65,69.64 52.5,69.64
GND on Inner2: 37.11,65.4 38.39,65.4 38.39,64.38 37.11,64.38
GND on Inner2: 35.76,2.32 37.04,2.32 37.04,1.3 35.76,1.3
GND on Inner2: 25.39,74.37 26.63,74.37 26.63,73.22 25.39,73.22
GND on Inner2: 34.57,67.94 35.85,67.94 35.85,66.92 34.57,66.92
GND on Inner2: 20.97,70.04 22.12,70.04 22.12,68.79 20.97,68.79
GND on Inner2: 26.79,67.12 27.81,67.12 27.81,65.84 26.79,65.84
GND on Inner2: 35.68,61.43 36.7,61.43 36.7,60.15 35.68,60.15
GND on Inner2: 26.66,72.17 27.9,72.17 27.9,71.02 26.66,71.02
GND on Inner2: 44.15,62.86 45.43,62.86 45.43,61.84 44.15,61.84
GND on Inner2: 45.84,69.05 46.86,69.05 46.86,67.77 45.84,67.77
GND on Inner2: 56.95,73.51 58.1,73.51 58.1,72.26 56.95,72.26
GND on Inner2: 33.14,61.43 34.16,61.43 34.16,60.15 33.14,60.15
GND on Inner2: 41.61,60.32 42.89,60.32 42.89,59.3 41.61,59.3
GND on Inner2: 44.73,67.94 46.01,67.94 46.01,66.92 44.73,66.92
GND on Inner2: 45.72,50.02 46.73,50.02 46.73,48.74 45.72,48.74
GND on Inner2: 45.84,61.43 46.86,61.43 46.86,60.15 45.84,60.15
GND on Inner2: 46.69,62.86 47.97,62.86 47.97,61.84 46.69,61.84
GND on Inner2: 43.3,59.48 44.32,59.48 44.32,58.19 43.3,58.19
GND on Inner2: 19.7,72.24 20.85,72.24 20.85,70.99 19.7,70.99
GND on Inner2: 39.65,60.32 40.93,60.32 40.93,59.3 39.65,59.3
GND on Inner2: 22.26,69.63 23.5,69.63 23.5,68.48 22.26,68.48
GND on Inner2: 61.35,70.97 62.5,70.97 62.5,69.72 61.35,69.72
GND on Inner2: 13.53,58.01 14.81,58.01 14.81,56.99 13.53,56.99
GND on Inner2: 34.57,65.4 35.85,65.4 35.85,64.38 34.57,64.38
GND on Inner2: 43.3,69.05 44.32,69.05 44.32,67.77 43.3,67.77
GND on Inner2: 33.14,64.56 34.16,64.56 34.16,63.27 33.14,63.27
GND on Inner2: 18.37,67.38 19.61,67.38 19.61,66.24 18.37,66.24
GND on Inner2: 33.14,59.48 34.16,59.48 34.16,58.19 33.14,58.19
GND on Inner2: 38.22,59.48 39.24,59.48 39.24,58.19 38.22,58.19
GND on Inner2: 44.15,65.4 45.43,65.4 45.43,64.38 44.15,64.38
GND on Inner2: 17.1,69.58 18.34,69.58 18.34,68.44 17.1,68.44
